# EAGLE design PoBoV1 (EAGLE 9.6.2)
ABTEILUNG: Technische Informatik; BEARBEITER: Stefan Sekulić; BENENNUNG: PowerHub; DATUM: 26.12.2024; DOKUMENTART: Schaltplan; GEZ: SekS; ID: 4BHEL; REV: 1.0; STATUS: Prototyp; VER: 1.0

## Sheet 1 of 5: THE INTELLIGENT PSU.
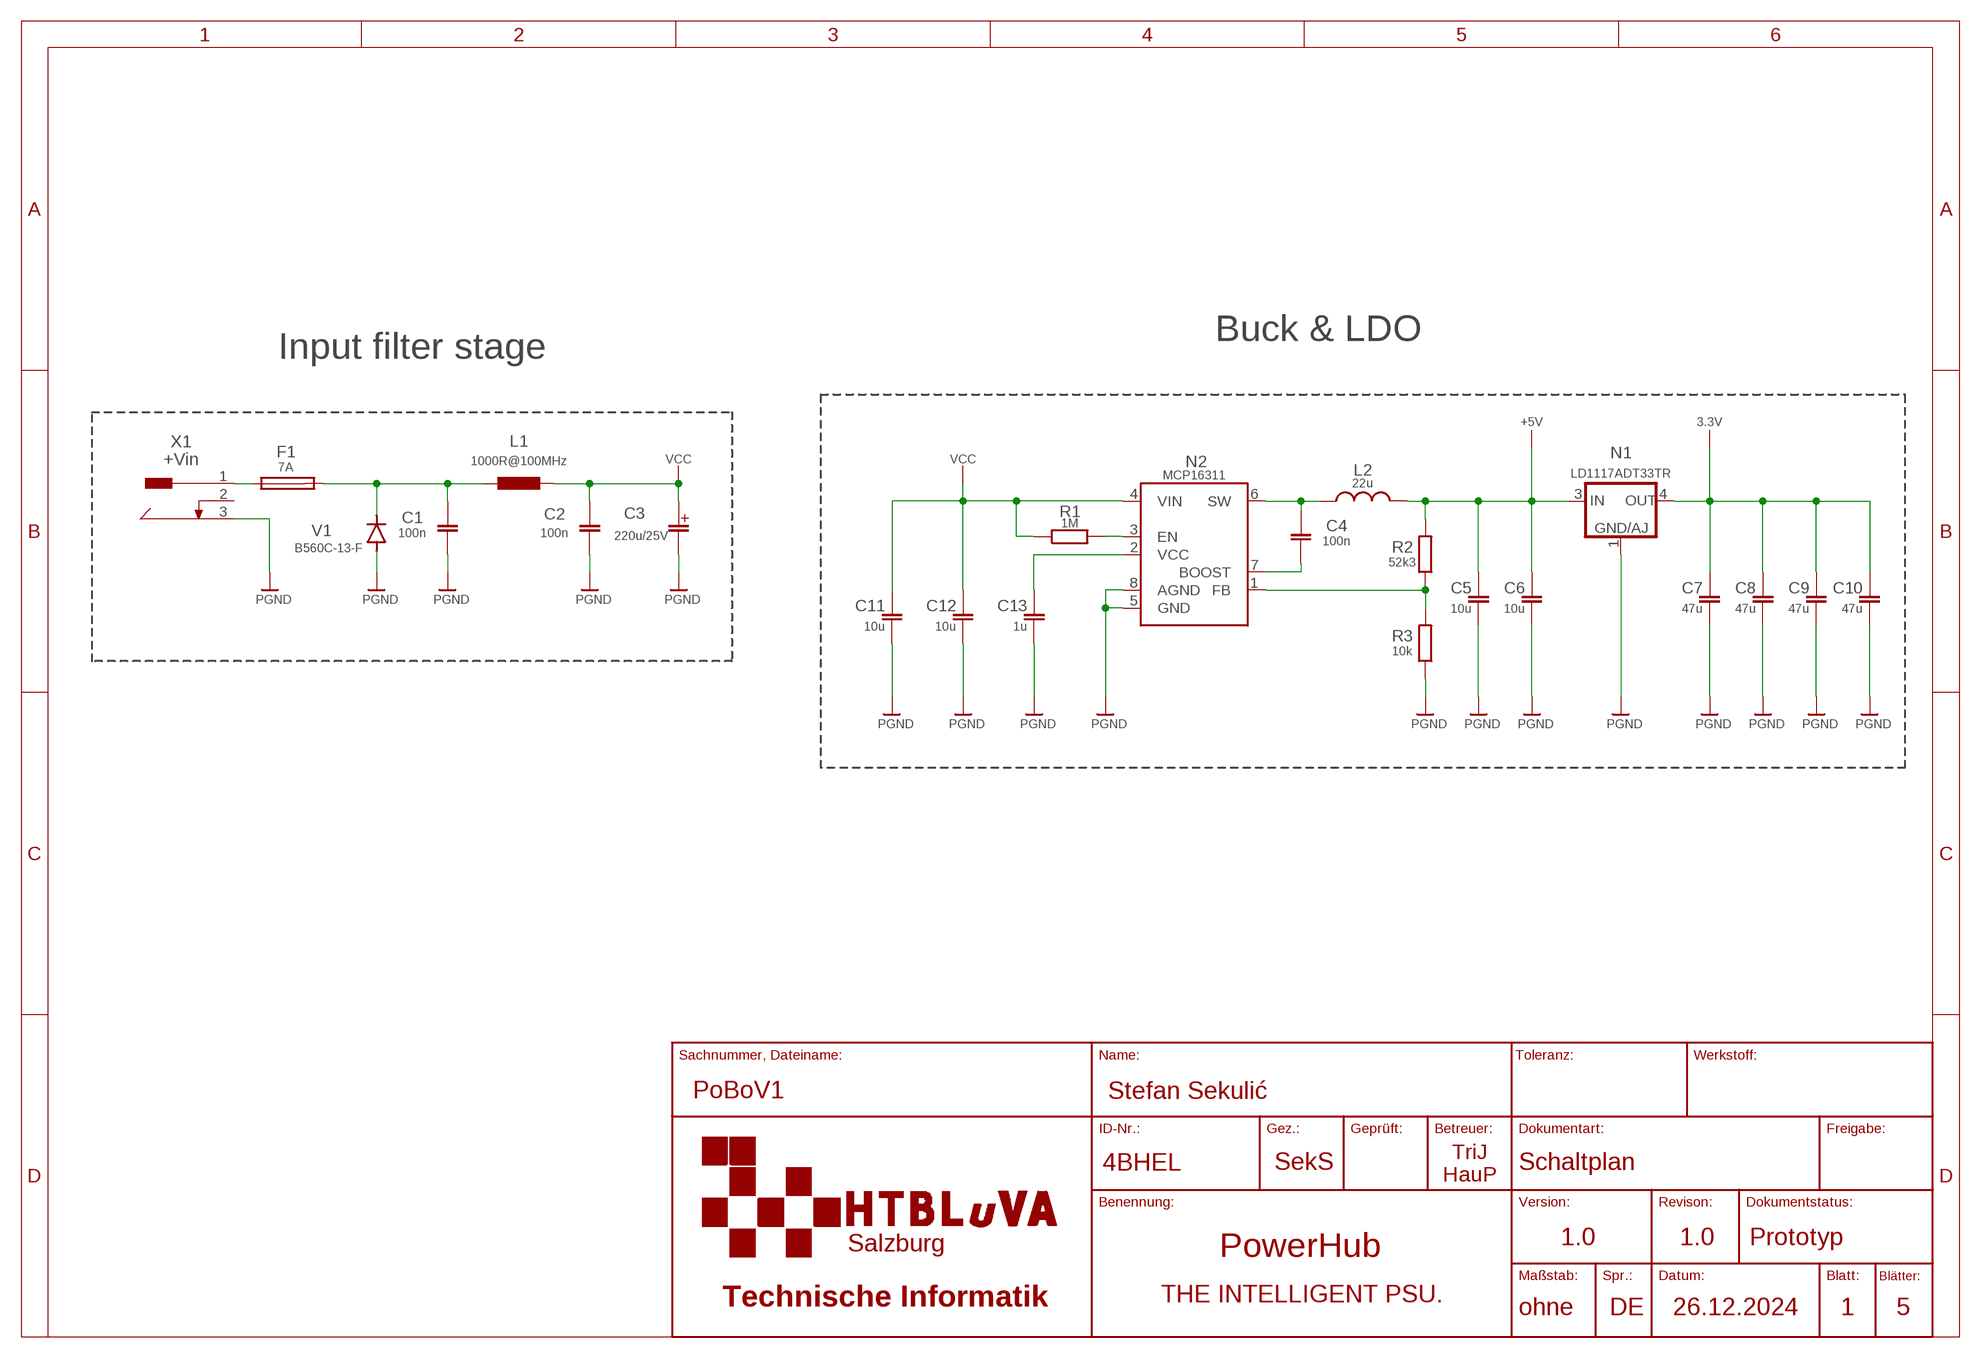
[diagram p0: schematic, sheet 1]

### Parts
C1  100n  C-EUC0805  [C0805]
C2  100n  C-EUC0805  [C0805]
C3  220u/25V  CPOL-EUE2,5-6L  [E2,5-6L]
C4  100n  C-EUC0805  [C0805]
C5  10u  C-EUC0805  [C0805]
C6  10u  C-EUC0805  [C0805]
C7  47u  C-EUC0805  [C0805]
C8  47u  C-EUC0805  [C0805]
C9  47u  C-EUC0805  [C0805]
C10  47u  C-EUC0805  [C0805]
C11  10u  C-EUC0805  [C0805]
C12  10u  C-EUC0805  [C0805]
C13  1u  C-EUC0805  [C0805]
F1  7A  TE5  [TE5]
L1  1000R@100MHz  L-EUL0204/7  [0204/7@1]
L2  22u  SPULETPC5818  [WE-TPC_5818/5828]
N1  LD1117ADT33TR  [DPACK]
N2  MCP16311  [MSOP8]
R1  1M  R-EU_R0805  [R0805]
R2  52k3  R-EU_R0805  [R0805]
R3  10k  R-EU_R0805  [R0805]
V1  B560C-13-F  [SMC]
X1  +Vin  DCJ0202  [DCJ0202]

### Nets
+3.3: C7.1 C8.1 C9.1 C10.1 N1.4(OUT) ; supply symbol labelled 3.3V ; also sheet 2,5
+5V: C5.1 C6.1 L2.2 N1.3(IN) R2.2 ; also sheet 2
N$1: F1.1 X1.1
N$2: C4.2 N2.7(BOOST)
N$19: N2.3(EN) R1.2
N$20: C1.1 F1.2 L1.1 V1.C
N$29: C4.1 L2.1 N2.6(SW)
N$31: N2.1(FB) R2.1 R3.2
N$34: C13.1 N2.2(VCC)
PGND: C1.2 C2.2 C3.- C5.2 C6.2 C7.2 C8.2 C9.2 C10.2 C11.2 C12.2 C13.2 N1.1(GND/ADJ) N2.5(GND) N2.8(AGND) R3.1 V1.A X1.3 ; also sheet 2,3,4,5
VCC: C2.1 C3.+ C11.1 C12.1 L1.2 N2.4(VIN) R1.1 ; also sheet 3,4
Unconnected: X1.2

### Notes on the sheet
- Buck & LDO
- Input filter stage
- TriJ
  HauP

## Sheet 2 of 5: THE INTELLIGENT PSU.
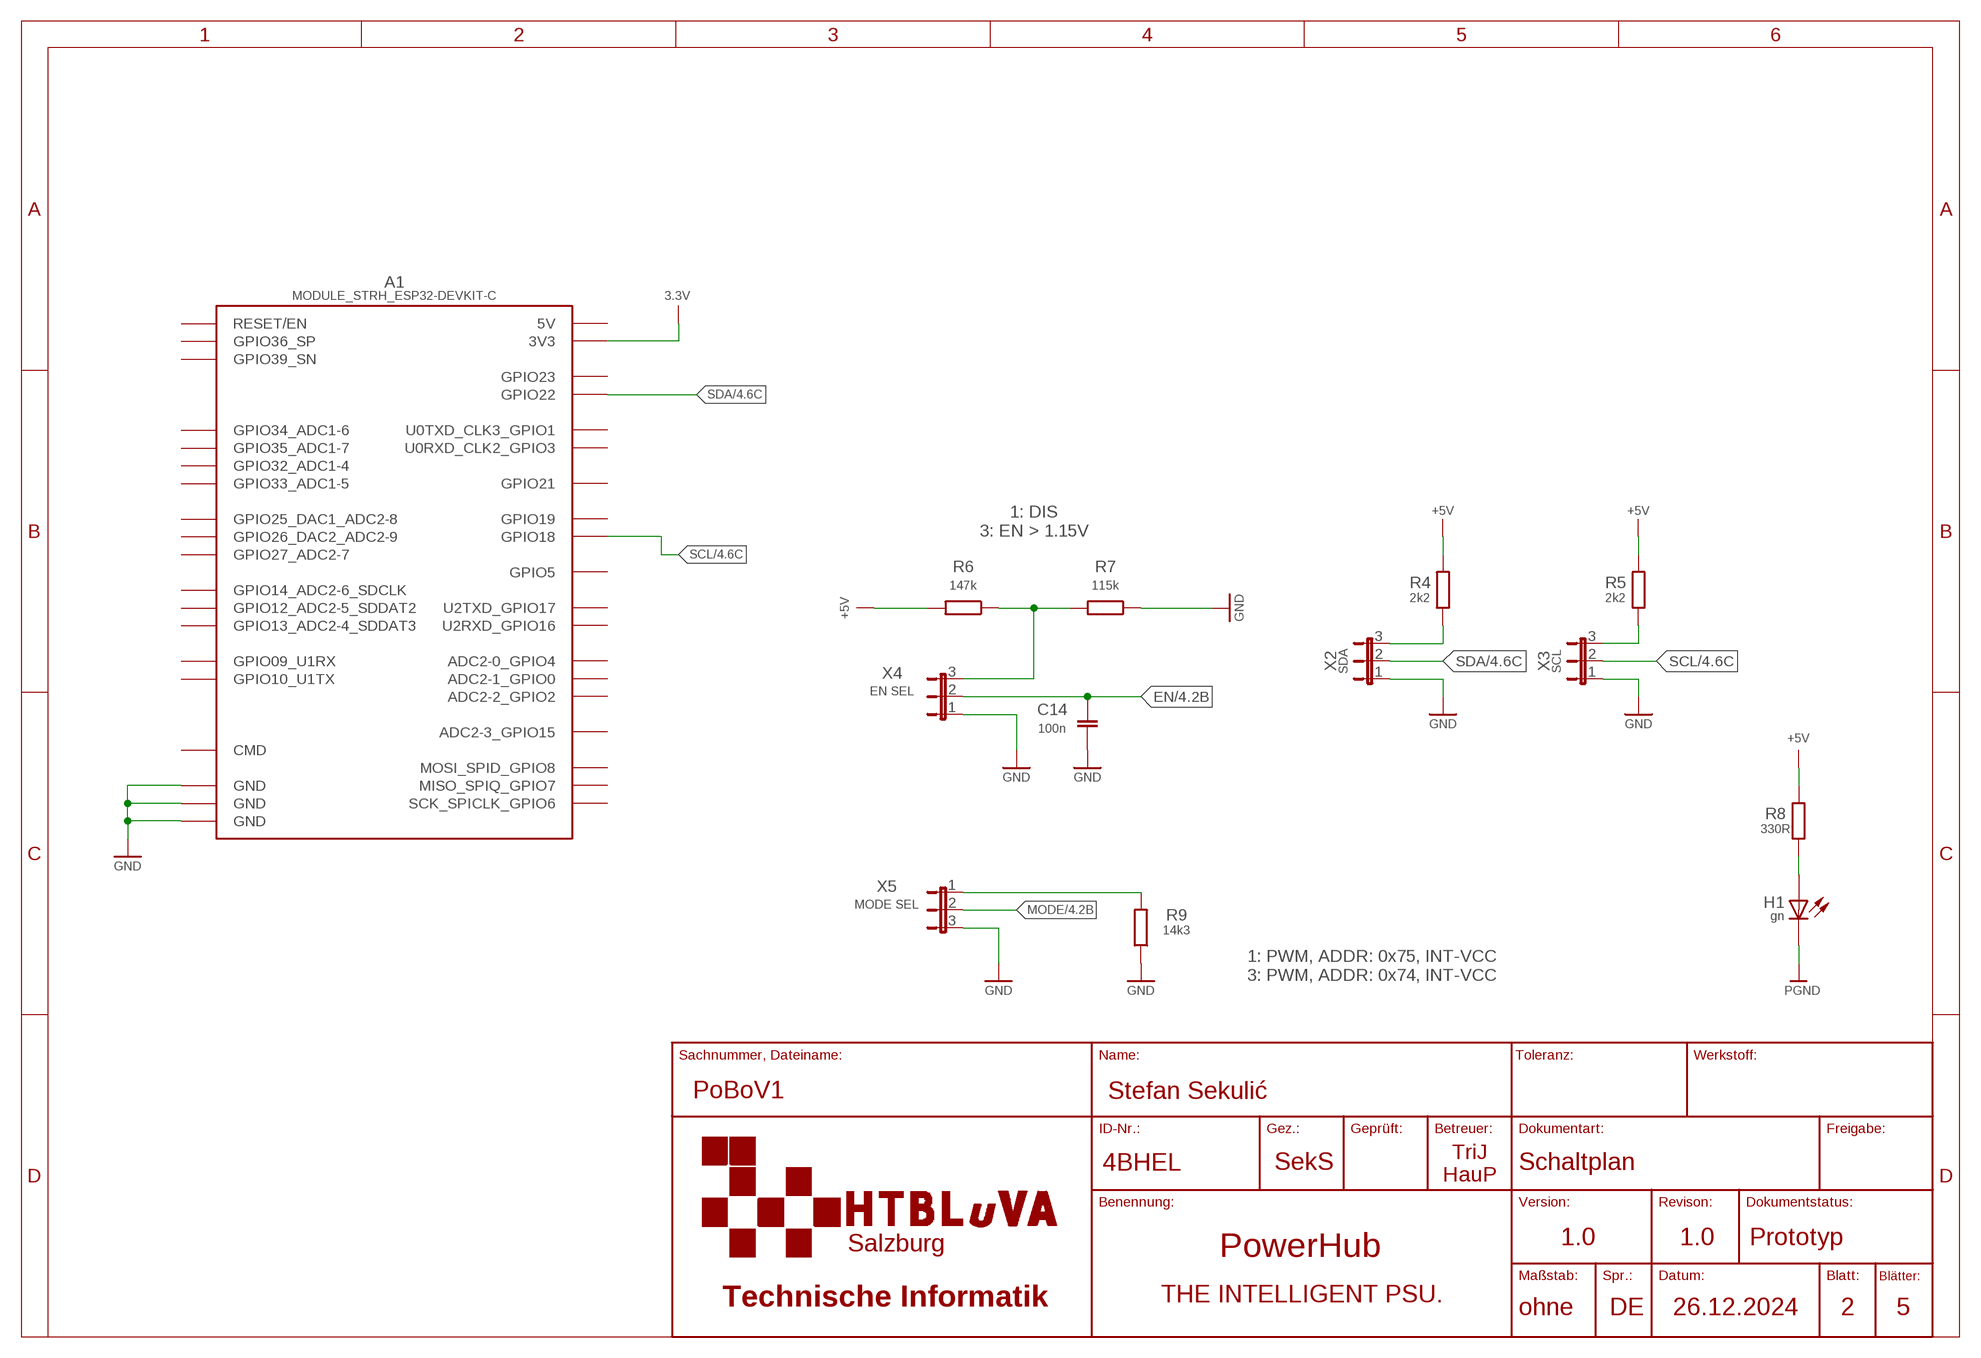
[diagram p1: schematic, sheet 2]

### Parts
A1  MODULE_STRH_ESP32-DEVKIT-C  [MODULE_STRH_DIL38-10_ESP]
C14  100n  C-EUC0805  [C0805]
H1  gn  LEDCHIPLED_0805  [CHIPLED_0805]
R4  2k2  R-EU_R0805  [R0805]
R5  2k2  R-EU_R0805  [R0805]
R6  147k  R-EU_R0805  [R0805]
R7  115k  R-EU_R0805  [R0805]
R8  330R  R-EU_R0805  [R0805]
R9  14k3  R-EU_R0805  [R0805]
X2  SDA  JUMPER_JP3EJP3E  [JUMPER_JP3]
X3  SCL  JUMPER_JP3EJP3E  [JUMPER_JP3]
X4  EN SEL  JUMPER_JP3EJP3E  [JUMPER_JP3]
X5  MODE SEL  JUMPER_JP3EJP3E  [JUMPER_JP3]

### Nets
+3.3: A1.3V3 ; supply symbol labelled 3.3V ; also sheet 1,5
+5V: R4.2 R5.2 R6.2 R8.2 ; also sheet 1
EN: C14.1 X4.2 ; also sheet 4
MODE: X5.2 ; also sheet 4
N$7: R6.1 R7.2 X4.3
N$9: R4.1 X2.3
N$10: R5.1 X3.3
N$17: H1.A R8.1
N$18: R9.2 X5.1
PGND: A1.GND A1.GND@1(GND) A1.GND@2(GND) C14.2 H1.C R7.1 R9.1 X2.1 X3.1 X4.1 X5.3 ; supply symbol labelled GND ; also sheet 1,3,4,5
SCL: A1.GPIO18 X3.2 ; also sheet 4,5
SDA: A1.GPIO22 X2.2 ; also sheet 4,5
Unconnected: A1.5V A1.CMD A1.EN(RESET/EN) A1.GPIO00(ADC2-1_GPIO0) A1.GPIO01(U0TXD_CLK3_GPIO1) A1.GPIO02(ADC2-2_GPIO2) A1.GPIO03(U0RXD_CLK2_GPIO3) A1.GPIO04(ADC2-0_GPIO4) A1.GPIO05(GPIO5) A1.GPIO06(SCK_SPICLK_GPIO6) A1.GPIO07(MISO_SPIQ_GPIO7) A1.GPIO08(MOSI_SPID_GPIO8) A1.GPIO09(GPIO09_U1RX) A1.GPIO10(GPIO10_U1TX) A1.GPIO12(GPIO12_ADC2-5_SDDAT2) A1.GPIO13(GPIO13_ADC2-4_SDDAT3) A1.GPIO14(GPIO14_ADC2-6_SDCLK) A1.GPIO15(ADC2-3_GPIO15) A1.GPIO16(U2RXD_GPIO16) A1.GPIO17(U2TXD_GPIO17) A1.GPIO19 A1.GPIO21 A1.GPIO23 A1.GPIO25(GPIO25_DAC1_ADC2-8) A1.GPIO26(GPIO26_DAC2_ADC2-9) A1.GPIO27(GPIO27_ADC2-7) A1.GPIO32(GPIO32_ADC1-4) A1.GPIO33(GPIO33_ADC1-5) A1.GPIO34(GPIO34_ADC1-6) A1.GPIO35(GPIO35_ADC1-7) A1.SN(GPIO39_SN) A1.SP(GPIO36_SP)

### Notes on the sheet
- 1: DIS
  3: EN > 1.15V
- 1: PWM, ADDR: 0x75, INT-VCC
  3: PWM, ADDR: 0x74, INT-VCC
- TriJ
  HauP

## Sheet 3 of 5: THE INTELLIGENT PSU.
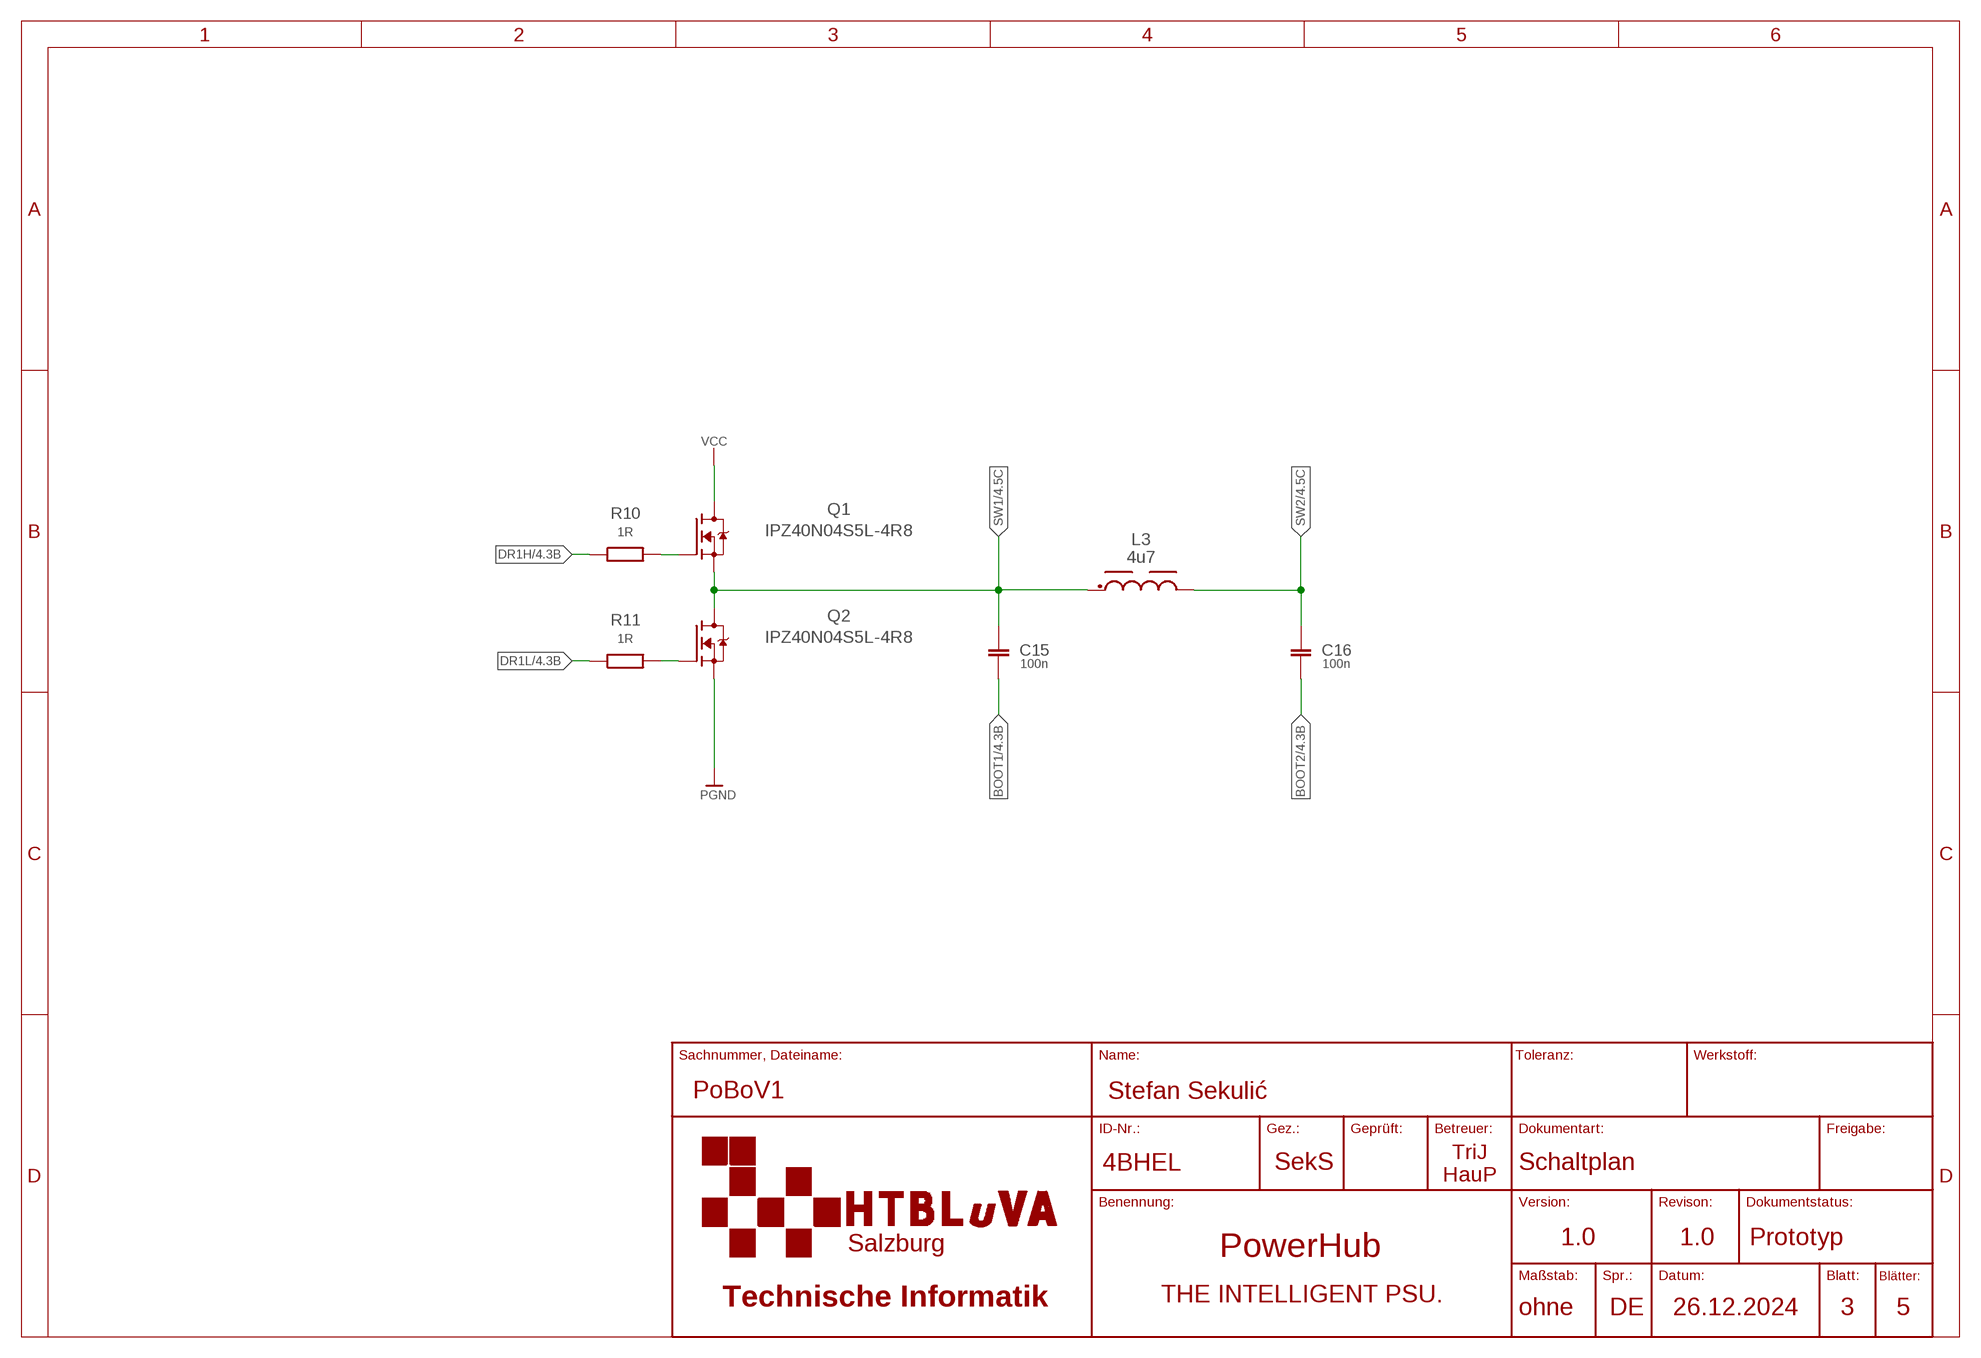
[diagram p2: schematic, sheet 3]

### Parts
C15  100n  C-EUC0805  [MYLIB_C0805]
C16  100n  C-EUC0805  [MYLIB_C0805]
L3  4u7  WE-PD_1280P  [WE-PD_1280P]
Q1  IPZ40N04S5L-4R8  BSZ100N06LS3_G  [TRANS_BSZ100N06LS3_G]
Q2  IPZ40N04S5L-4R8  BSZ100N06LS3_G  [TRANS_BSZ100N06LS3_G]
R10  1R  R-EU_R0805  [R0805]
R11  1R  R-EU_R0805  [R0805]

### Nets
BOOT1: C15.2 ; also sheet 4
BOOT2: C16.2 ; also sheet 4
DR1H: R10.1 ; also sheet 4
DR1L: R11.1 ; also sheet 4
N$3: Q1.4(G) R10.2
N$5: Q2.4(G) R11.2
PGND: Q2.1(S) Q2.2(S) Q2.3(S) ; also sheet 1,2,4,5
SW1: C15.1 L3.1 Q1.1(S) Q1.2(S) Q1.3(S) Q2.5_8(D) ; also sheet 4
SW2: C16.1 L3.2 ; also sheet 4
VCC: Q1.5_8(D) ; also sheet 1,4

### Notes on the sheet
- TriJ
  HauP

## Sheet 4 of 5: THE INTELLIGENT PSU.
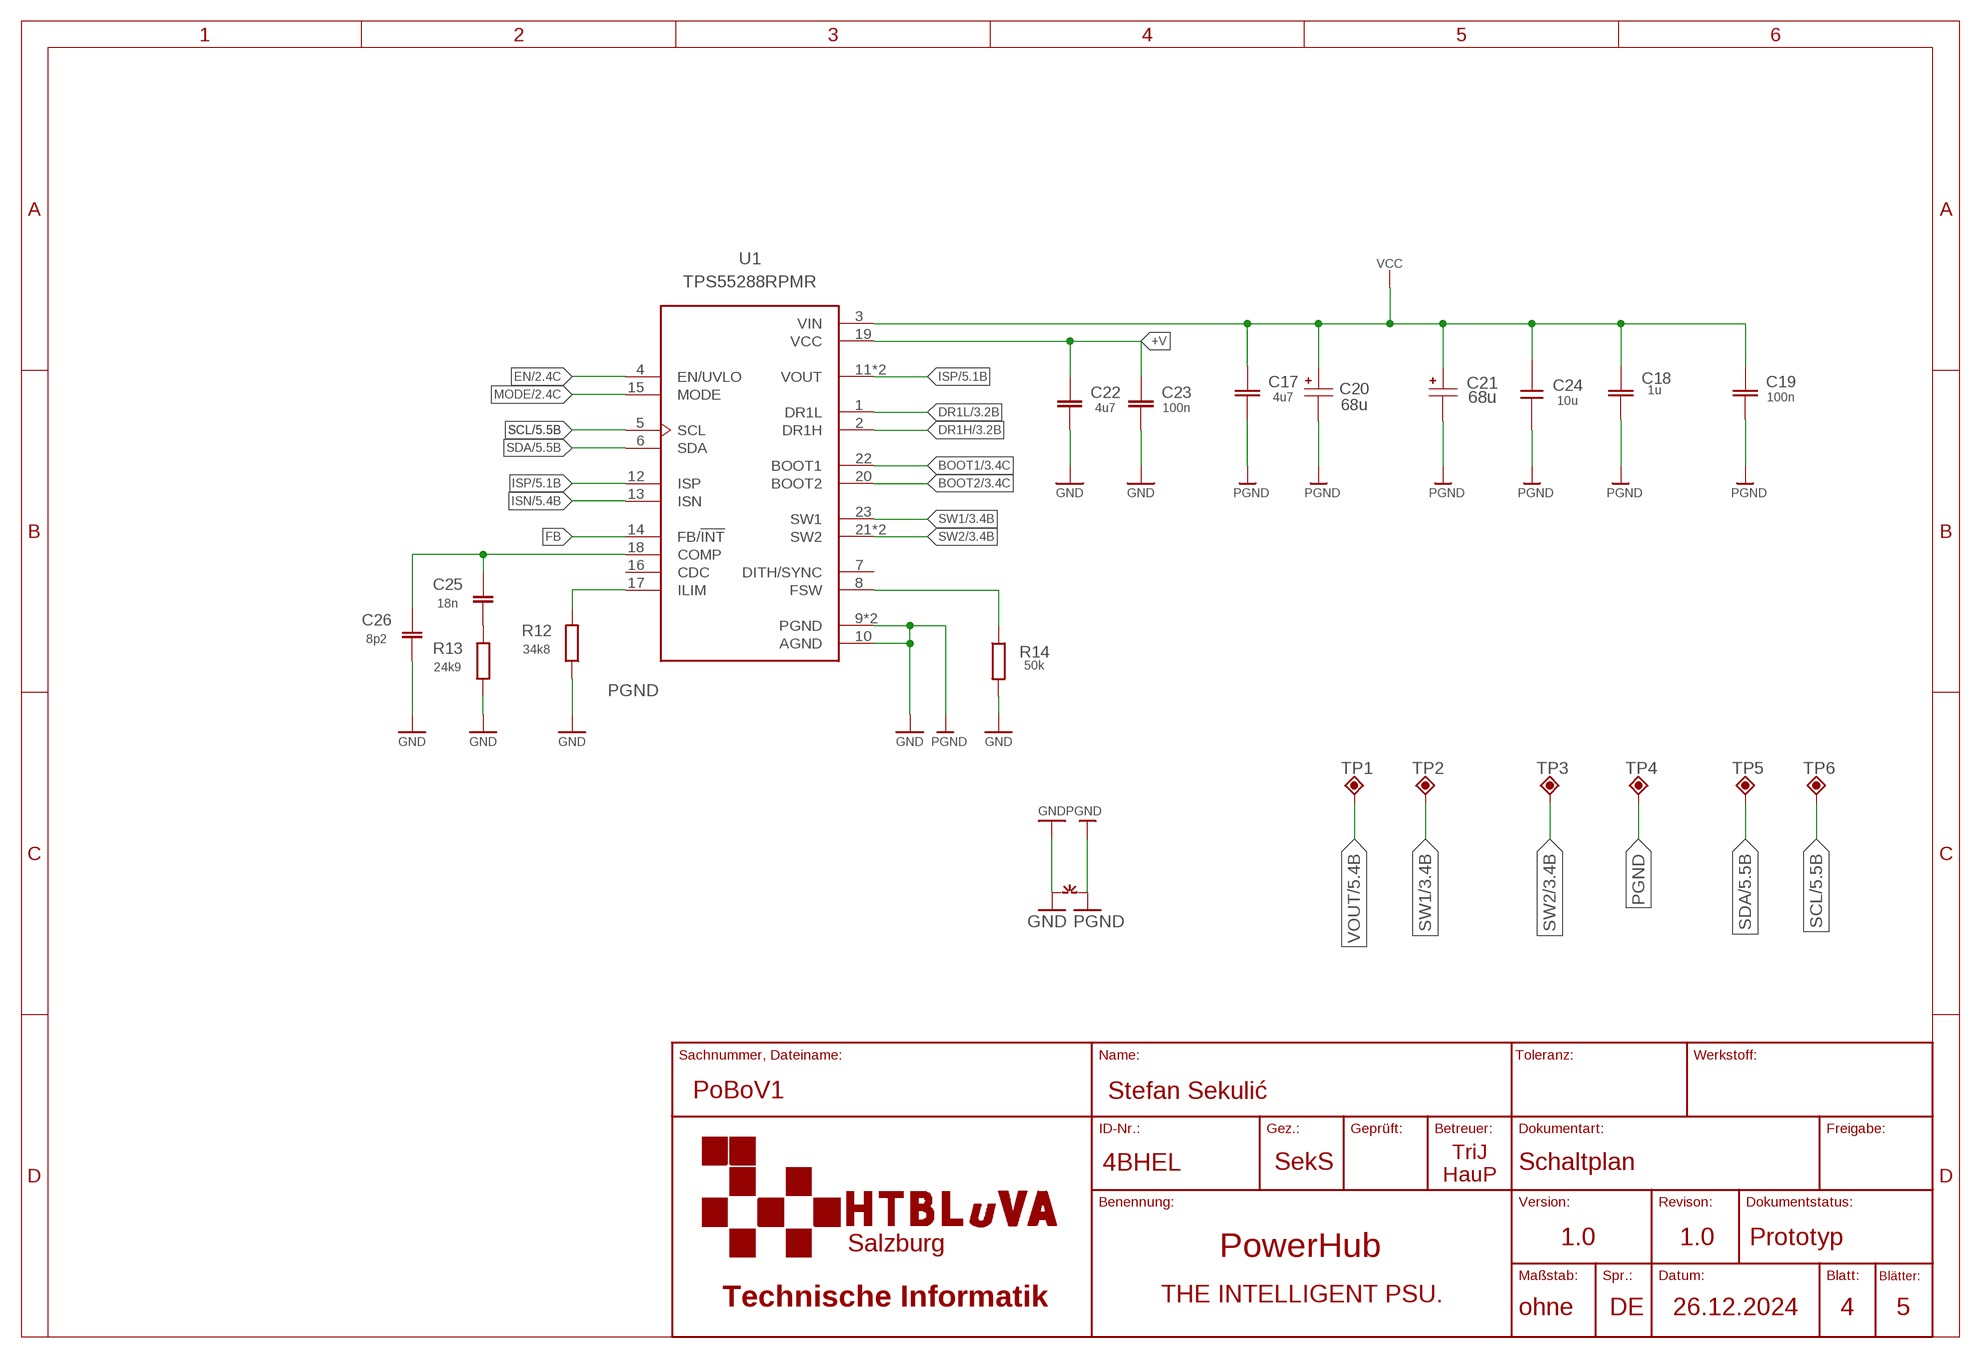
[diagram p3: schematic, sheet 4]

### Parts
C17  4u7  RCL_C-EUC0603  [MYRCL_C0603]
C18  1u  RCL_C-EUC0603K  [MYRCL_C0603K]
C19  100n  RCL_C-EUC0402  [MYRCL_C0402]
C20  68u  EEHZA1H680P  [CAP_EEHZA1H680P]
C21  68u  EEHZA1H680P  [CAP_EEHZA1H680P]
C22  4u7  RCL_C-EUC0603  [MYRCL_C0603]
C23  100n  RCL_C-EUC0603  [MYRCL_C0603]
C24  10u  C-EU_C1210  [C1210]
C25  18n  C-EUC0805  [MYLIB_C0805]
C26  8p2  C-EUC0805  [MYLIB_C0805]
R12  34k8  R-EU_R0805  [R0805]
R13  24k9  R-EU_R0805  [R0805]
R14  50k  R-EU_R0805  [R0805]
TP1  TPP-SMD-20SN  [SMD-20SN]
TP2  TPP-SMD-20SN  [SMD-20SN]
TP3  TPP-SMD-20SN  [SMD-20SN]
TP4  TPP-SMD-20SN  [SMD-20SN]
TP5  TPP-SMD-20SN  [SMD-20SN]
TP6  TPP-SMD-20SN  [SMD-20SN]
U1  TPS55288RPMR  [IC_TPS55288RPMR]
~NUDEV~1  GND-GNDA  [GND-GNDA]

### Nets
+V: C22.1 C23.1 U1.19(VCC)
BOOT1: U1.22(BOOT1) ; also sheet 3
BOOT2: U1.20(BOOT2) ; also sheet 3
DR1H: U1.2(DR1H) ; also sheet 3
DR1L: U1.1(DR1L) ; also sheet 3
EN: U1.4(EN/UVLO) ; also sheet 2
FB: U1.14(FB/!INT)
ISN: U1.13(ISN) ; also sheet 5
ISP: U1.11(VOUT) U1.12(ISP) U1.26(VOUT) ; also sheet 5
MODE: U1.15(MODE) ; also sheet 2
N$12: C25.2 R13.2
N$13: C25.1 C26.1 U1.18(COMP)
N$14: R14.1 U1.8(FSW)
N$15: R12.2 U1.17(ILIM)
PGND: C17.2 C18.2 C19.2 C20.2 C21.2 C22.2 C23.2 C24.2 C26.2 R12.1 R13.1 R14.2 TP4.TP(P) U1.9(PGND) U1.10(AGND) U1.24(PGND) ~NUDEV~1.GND ~NUDEV~1.PGND(GNDA) ; supply symbol labelled GND ; also sheet 1,2,3,5
SCL: TP6.TP(P) U1.5(SCL) ; also sheet 2,5
SDA: TP5.TP(P) U1.6(SDA) ; also sheet 2,5
SW1: TP2.TP(P) U1.23(SW1) ; also sheet 3
SW2: TP3.TP(P) U1.21(SW2) U1.25(SW2) ; also sheet 3
VCC: C17.1 C18.1 C19.1 C20.1 C21.1 C24.1 U1.3(VIN) ; also sheet 1,3
VOUT: TP1.TP(P) ; also sheet 5
Unconnected: U1.7(DITH/SYNC) U1.16(CDC)

### Notes on the sheet
- TriJ
  HauP

## Sheet 5 of 5: THE INTELLIGENT PSU.
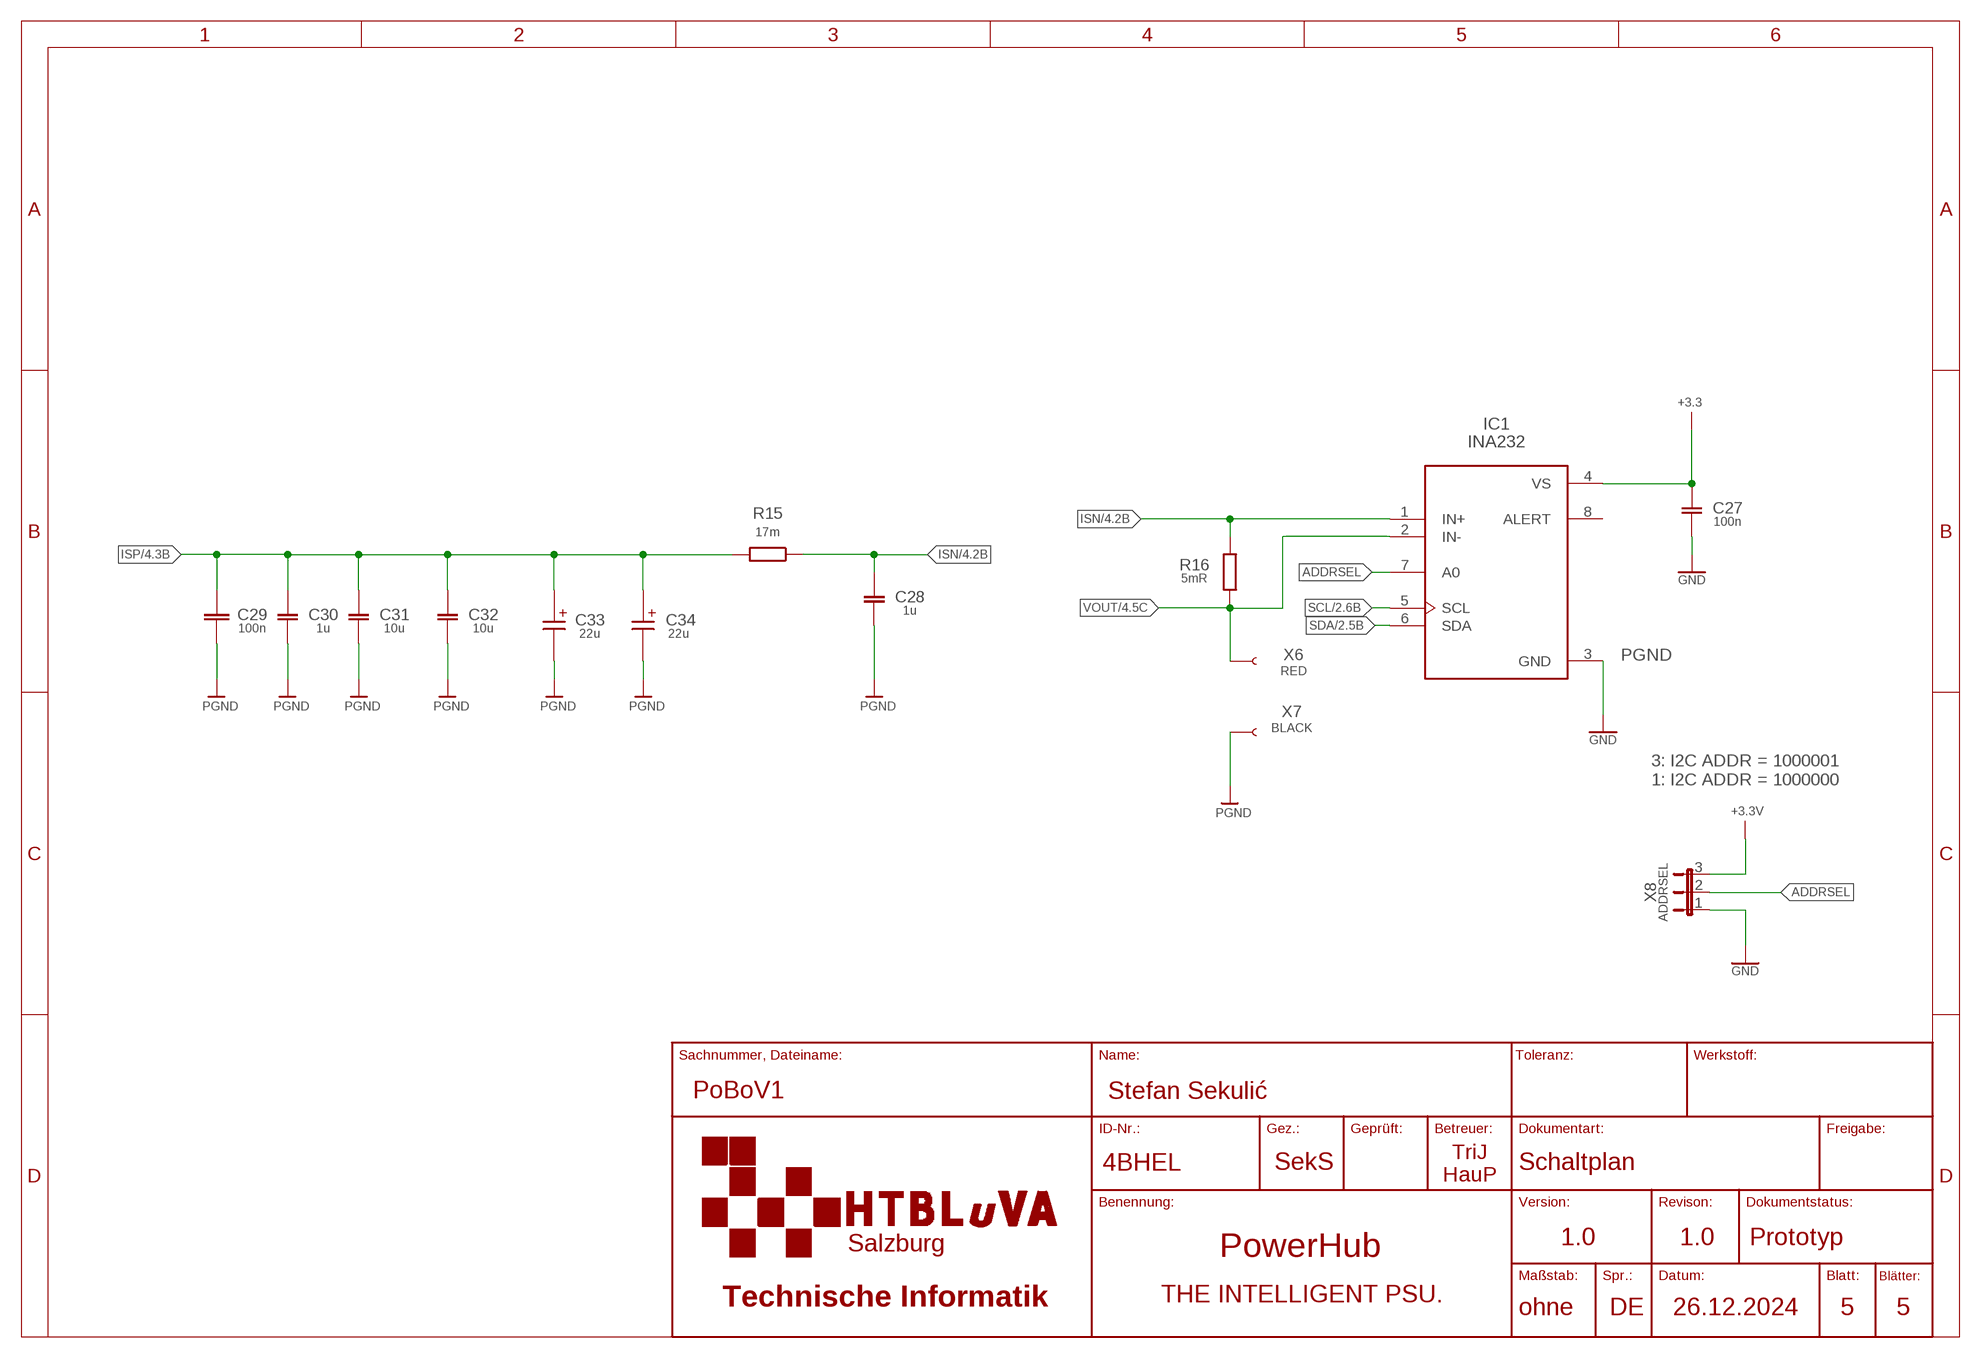
[diagram p4: schematic, sheet 5]

### Parts
C27  100n  C-EUC0805  [MYLIB_C0805]
C28  1u  C-EUC0805  [MYLIB_C0805]
C29  100n  RCL_C-EUC0402  [MYRCL_C0402]
C30  1u  C-EUC0805  [MYLIB_C0805]
C31  10u  C-EUC0805  [MYLIB_C0805]
C32  10u  C-EUC0805  [MYLIB_C0805]
C33  22u  C-POL_G  [PANASONIC_G]
C34  22u  C-POL_G  [PANASONIC_G]
IC1  INA232  INA232AIDDFR  [SOT65P280X110-8N]
R15  17m  R-EU_R0805  [R0805]
R16  5mR  RCL_STRH_R-EU_R0805  [RCL_STRH_R0805]
X6  RED  BANANAJACKBANANAJACK-RED  [BANANAJACK]
X7  BLACK  BANANAJACKBANANAJACK-BLACK  [BANANAJACK]
X8  ADDRSEL  JUMPER_JP3EJP3E  [JUMPER_JP3]

### Nets
+3.3: C27.1 IC1.4(VS) ; also sheet 1,2
+3.3V: X8.3
ADDRSEL: IC1.7(A0) X8.2
ISN: C28.1 IC1.1(IN+) R15.1 R16.2 ; also sheet 4
ISP: C29.1 C30.1 C31.1 C32.1 C33.+ C34.+ R15.2 ; also sheet 4
PGND: C27.2 C28.2 C29.2 C30.2 C31.2 C32.2 C33.- C34.- IC1.3(GND) X7.P$1 X8.1 ; supply symbol labelled GND ; also sheet 1,2,3,4
SCL: IC1.5(SCL) ; also sheet 2,4
SDA: IC1.6(SDA) ; also sheet 2,4
VOUT: IC1.2(IN-) R16.1 X6.P$1 ; also sheet 4
Unconnected: IC1.8(ALERT)

### Notes on the sheet
- 3: I2C ADDR = 1000001
  1: I2C ADDR = 1000000
- TriJ
  HauP

## Library data of the parts
A1 = Neo_V2.102R1 (1):MODULE_STRH_ESP32-DEVKIT-C
C1 C2 C4-C14 = rcl_STRH:C-EU: CAPACITOR, European symbol
C3 = rcl_STRH:CPOL-EU: POLARIZED CAPACITOR, European symbol
C15 C16 C25-C28 C30-C32 = RPoettinger:C-EU
C17-C19 C22 C23 C29 = RPoettinger:RCL_C-EU: CAPACITOR, European symbol
C20 C21 = EEHZA1H680P:EEHZA1H680P: Check availability <https://pricing.snapeda.com/parts/EEH-ZA1H680P/Panasonic%20Electronic/view-part?ref=eda>; AVAILABILITY: In Stock; CHECK_PRICES: https://www.snapeda.com/parts/EEH-ZA1H680P/Panasonic/view-part/?ref=eda; DESCRIPTION: Capacitor, Aluminum Electrolytic,Hybrid Al Lytic Cap, SMT ZA Series, 105C | Panasonic Electronic Components EEH-ZA1H680P; MF: Panasonic Electronic; MP: EEH-ZA1H680P; PACKAGE: RADIAL-2 Panasonic; PRICE: None; SNAPEDA_LINK: https://www.snapeda.com/parts/EEH-ZA1H680P/Panasonic/view-part/?ref=snap
C24 = rcl_SekS_V22:C-EU_: CAPACITOR, European symbol
C33 C34 = rcl_SekS_V22:C-POL_: POLARIZED CAPACITOR, European symbol
F1 = fuse_SekS:TE5: FUSE Wickmann; OC_FARNELL: unknown; OC_NEWARK: unknown
H1 = led_SekS_V21:LED: LED, EN-60617 OSRAM: - CHIPLED LG R971, LG N971, LY N971, LG Q971, LY Q971, LO R971, LY R971 LH N974, LH R974 LS Q976, LO Q976, LY Q976 LO Q996 - Hyper CHIPLED LW Q18S LB Q993, LB Q99A, LB R99A - SideLED LS A670, LO A670, LY A670, LG A670, LP A670 LB A673, LV A673, LT A673, LW A673 LH A674 LY A675 LS A676, LA A676, LO A676, LY A676, LW A676 LS A679, LY A679, LG A679 - Hyper Micro SIDELED® LS Y876, LA Y876, LO Y876, LY Y876 LT Y87S - SmartLED LW L88C, LW L88S LB L89C, LB L89S, LG L890 LS L89K, LO L89K, LY L89K LS L896, LA L896, LO L896, LY L896 - TOPLED LS T670, LO T670, LY T670, LG T670, LP T670 LSG T670, LSP T670, LSY T670, LOP T670, LYG T670 LG T671, LOG T671, LSG T671 LB T673, LV T673, LT T673, LW T673 LH T674 LS T676, LA T676, LO T676, LY T676, LB T676, LH T676, LSB T676, LW T676 LB T67C, LV T67C, LT T67C, LS T67K, LO T67K, LY T67K, LW E67C LS E67B, LA E67B, LO E67B, LY E67B, LB E67C, LV E67C, LT E67C LW T67C LS T679, LY T679, LG T679 LS T770, LO T770, LY T770, LG T770, LP T770 LB T773, LV T773, LT T773, LW T773 LH T774 LS E675, LA E675, LY E675, LS T675 LS T776, LA T776, LO T776, LY T776, LB T776 LHGB T686 LT T68C, LB T68C - Hyper Mini TOPLED® LB M676 - Mini TOPLED Santana® LG M470 LS M47K, LO M47K, LY M47K Source: http://www.osram.convergy.de LUXEON: - LUMILED® LXK2-PW12-R00, LXK2-PW12-S00, LXK2-PW14-U00, LXK2-PW14-V00 LXK2-PM12-R00, LXK2-PM12-S00, LXK2-PM14-U00 LXK2-PE12-Q00, LXK2-PE12-R00, LXK2-PE12-S00, LXK2-PE14-T00, LXK2-PE14-U00 LXK2-PB12-K00, LXK2-PB12-L00, LXK2-PB12-M00, LXK2-PB14-N00, LXK2-PB14-P00, LXK2-PB14-Q00 LXK2-PR12-L00, LXK2-PR12-M00, LXK2-PR14-Q00, LXK2-PR14-R00 LXK2-PD12-Q00, LXK2-PD12-R00, LXK2-PD12-S00 LXK2-PH12-R00, LXK2-PH12-S00 LXK2-PL12-P00, LXK2-PL12-Q00, LXK2-PL12-R00 Source: www.luxeon.com KINGBRIGHT: KA-3528ASYC Source: www.kingbright.com
IC1 = INA232AIDDFR:INA232AIDDFR: Check availability <https://pricing.snapeda.com/parts/INA232AIDDFR/Texas%20Instruments/view-part?ref=eda>; AVAILABILITY: In Stock; CHECK_PRICES: https://www.snapeda.com/parts/INA232AIDDFR/Texas+Instruments/view-part/?ref=eda; DESCRIPTION: 48-V, 16-bit high-precision I²C output digital power monitor with alert; MF: Texas Instruments; MP: INA232AIDDFR; PACKAGE: SOT-23-THN-8 Texas Instruments; PRICE: None; SNAPEDA_LINK: https://www.snapeda.com/parts/INA232AIDDFR/Texas+Instruments/view-part/?ref=snap
L1 = rcl_STRH:L-EUL: INDUCTOR, European symbol; SPICEPREFIX: L
L2 = inductor_STRH:SPULE
L3 = WE-PD_1280P:WE-PD_1280P: WE-PD SMT Power Inductor Characteristics AECQ 200 Qualified Ultra low RDC and RAC Highest possible saturation current based on Ferrite Suitable for switching frequency up to 10MHz Temperature dependent parameter available on Redexpert Operating Temperature from -40°C to +125°C / +150°C Types WE-PD: Since always with low loss material, tight tolerances and high saturation behavior compared to other manufacturers in the market WE-PD Robust: Plastic base improves the mechanical stability and efficiency WE-PD Performance: MnZn core improves Saturation and RDC for highest efficiency Applications Switch Mode Power supplies from 0,1W up to 300W Integrated DC DC Converter Ideal for Switch Mode Power supplies with extreme high efficiency (>95%) <https://www.we-online.com/components/media/o194227v209%20Family_WE-PD.jpg> Details see: www.we-online.com/en/components/products/WE-PD Updated by Ella Wu 2023-02-17 2023 (C) Wurth Elektronik Check availability <https://pricing.snapeda.com/parts/7447707047/Wurth%20Elektronik/view-part?ref=eda>; AVAILABILITY: In Stock; CHECK_PRICES: https://www.snapeda.com/parts/7447707047/Wurth+Electronics/view-part/?ref=eda; DESCRIPTION: Size 1280; L = 4,7 µH ±30%; IR = 8,5 A; Isat = 15,5 A; RDC = 10 mΩ; MF: Wurth Elektronik; MP: 7447707047; PACKAGE: None; PRICE: None; SNAPEDA_LINK: https://www.snapeda.com/parts/7447707047/Wurth+Electronics/view-part/?ref=snap
N1 = v-reg_STRH:LD1117A?*: Low drop fixed and adjustable positive voltage regulators 1 A Source: http://www.st.com/stonline/products/literature/ds/7194/ld1117axx.pdf
N2 = v-reg_STRH:MCP16311
Q1 Q2 = BSZ100N06LS3_G:BSZ100N06LS3_G: Check availability <https://pricing.snapeda.com/parts/BSZ100N06LS3%20G/Infineon/view-part?ref=eda>; AVAILABILITY: In Stock; CHECK_PRICES: https://www.snapeda.com/parts/BSZ100N06LS3%20G/Infineon/view-part/?ref=eda; DESCRIPTION: MOSFET N-Ch 60V 20A TSDSON-8 OptiMOS 3; MF: Infineon; MP: BSZ100N06LS3 G; PACKAGE: PowerVDFN-8 Infineon Technologies; PRICE: None; SNAPEDA_LINK: https://www.snapeda.com/parts/BSZ100N06LS3%20G/Infineon/view-part/?ref=snap
R1-R9 = rcl_STRH:R-EU_: RESISTOR, European symbol
R10-R15 = RPoettinger:R-EU_: RESISTOR, European symbol
R16 = Neo_V2.102R1:RCL_STRH_R-EU_: RESISTOR, European symbol
TP1-TP6 = testpoint:TPP: TEST POINT PAD; BOM: EXCLUDE
U1 = TPS55288RPMR:TPS55288RPMR: Check availability <https://pricing.snapeda.com/parts/TPS55288RPMR/Texas%20Instruments/view-part?ref=eda>; AVAILABILITY: In Stock; CHECK_PRICES: https://www.snapeda.com/parts/TPS55288RPMR/Texas+Instruments/view-part/?ref=eda; DESCRIPTION: 36V, 16A buck-boost converter with PPS control; MF: Texas Instruments; MP: TPS55288RPMR; PACKAGE: VQFN-HR-26 Texas Instruments; PRICE: None; PURCHASE-URL: https://www.snapeda.com/api/url_track_click_mouser/?unipart_id=4817645&manufacturer=Texas Instruments&part_name=TPS55288RPMR&search_term=None; SNAPEDA_LINK: https://www.snapeda.com/parts/TPS55288RPMR/Texas+Instruments/view-part/?ref=snap
V1 = B560C-13-F:B560C-13-F: Diode Schottky 700mA 5A inverse 60V Check availability <https://pricing.snapeda.com/parts/B560C-13-F/Diodes%20Inc./view-part?ref=eda>; AVAILABILITY: In Stock; CHECK_PRICES: https://www.snapeda.com/parts/B560C-13-F/Diodes+Inc./view-part/?ref=eda; DESCRIPTION: Diode Schottky 60 V 5A Surface Mount SMC; MF: Diodes Inc.; MP: B560C-13-F; PACKAGE: SMC-2 Diodes; PRICE: None; SNAPEDA_LINK: https://www.snapeda.com/parts/B560C-13-F/Diodes+Inc./view-part/?ref=snap
X1 = StefkeJack:DCJ0202: DC POWER JACK Source: DCJ0202.pdf; OC_FARNELL: unknown; OC_NEWARK: unknown
X2-X5 = RPoettinger:JUMPER_JP3E: JUMPER
X6 X7 = con_PoeD:BANANAJACK
X8 = StefNe555:JUMPER_JP3E: JUMPER
~NUDEV~1 = supply-dummy:GND-GNDA: Example of GND--GNDA NET-Connetor for more info read description in package

## Net classes
1 GND: width 0.508 mm
2 SUP: width 0.508 mm

## Board
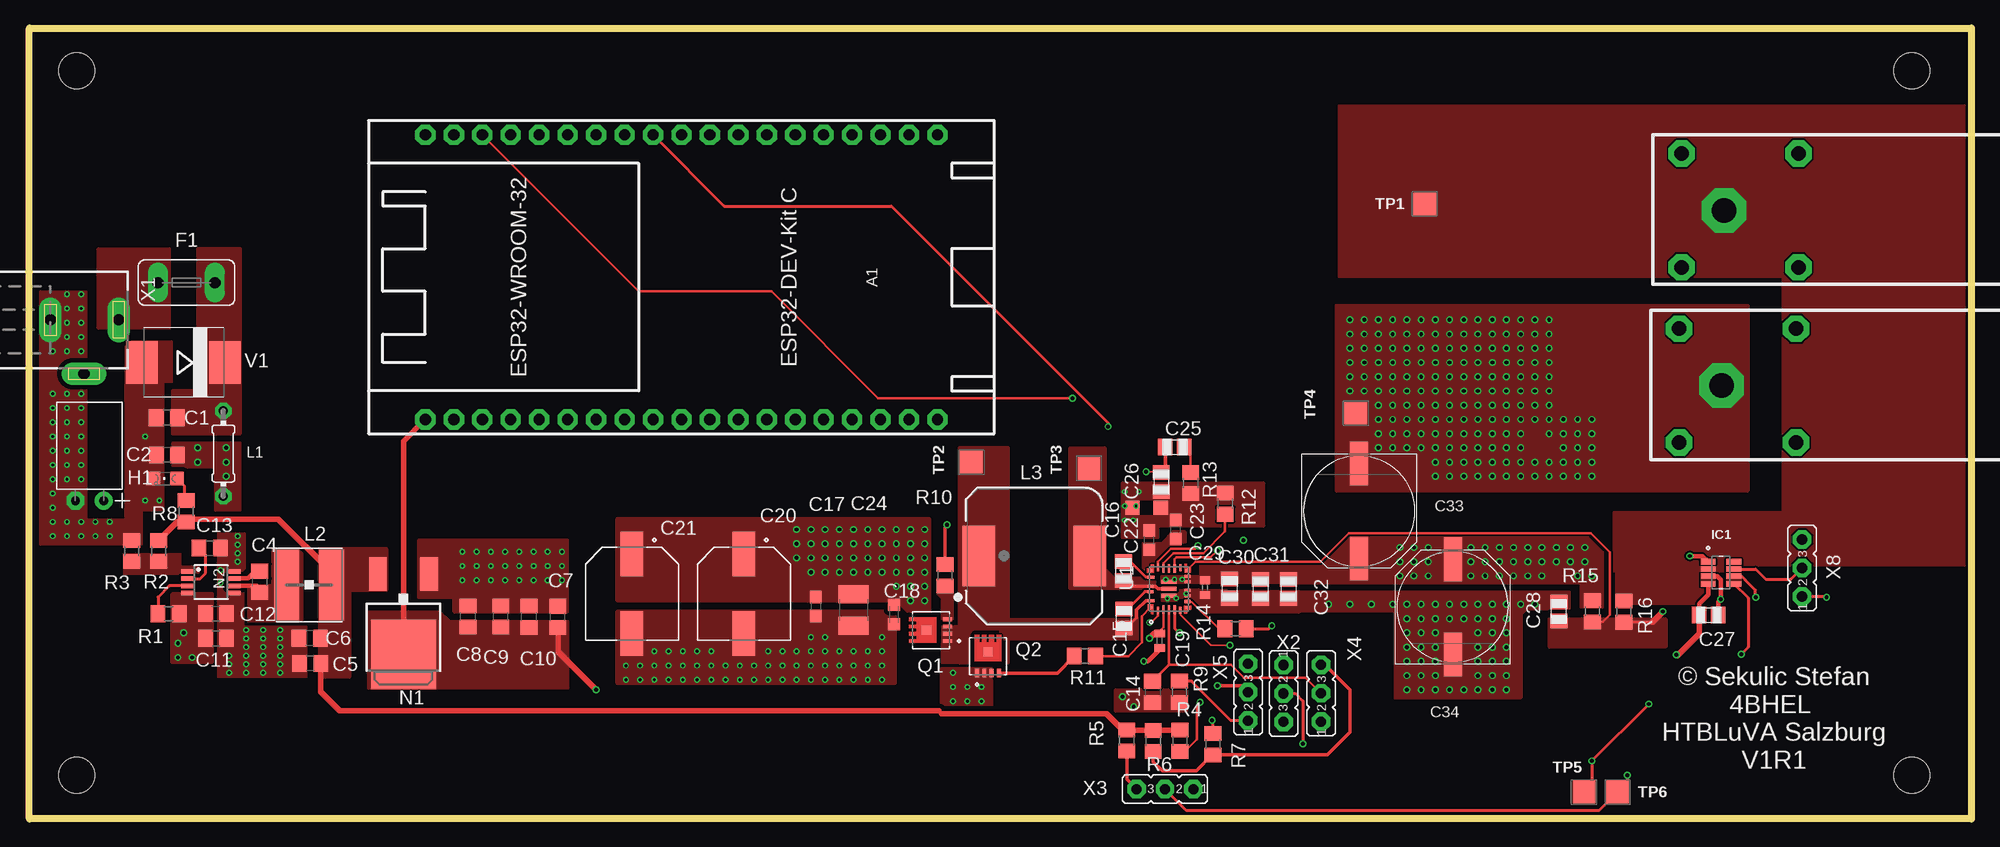
[diagram p5: board, top side]
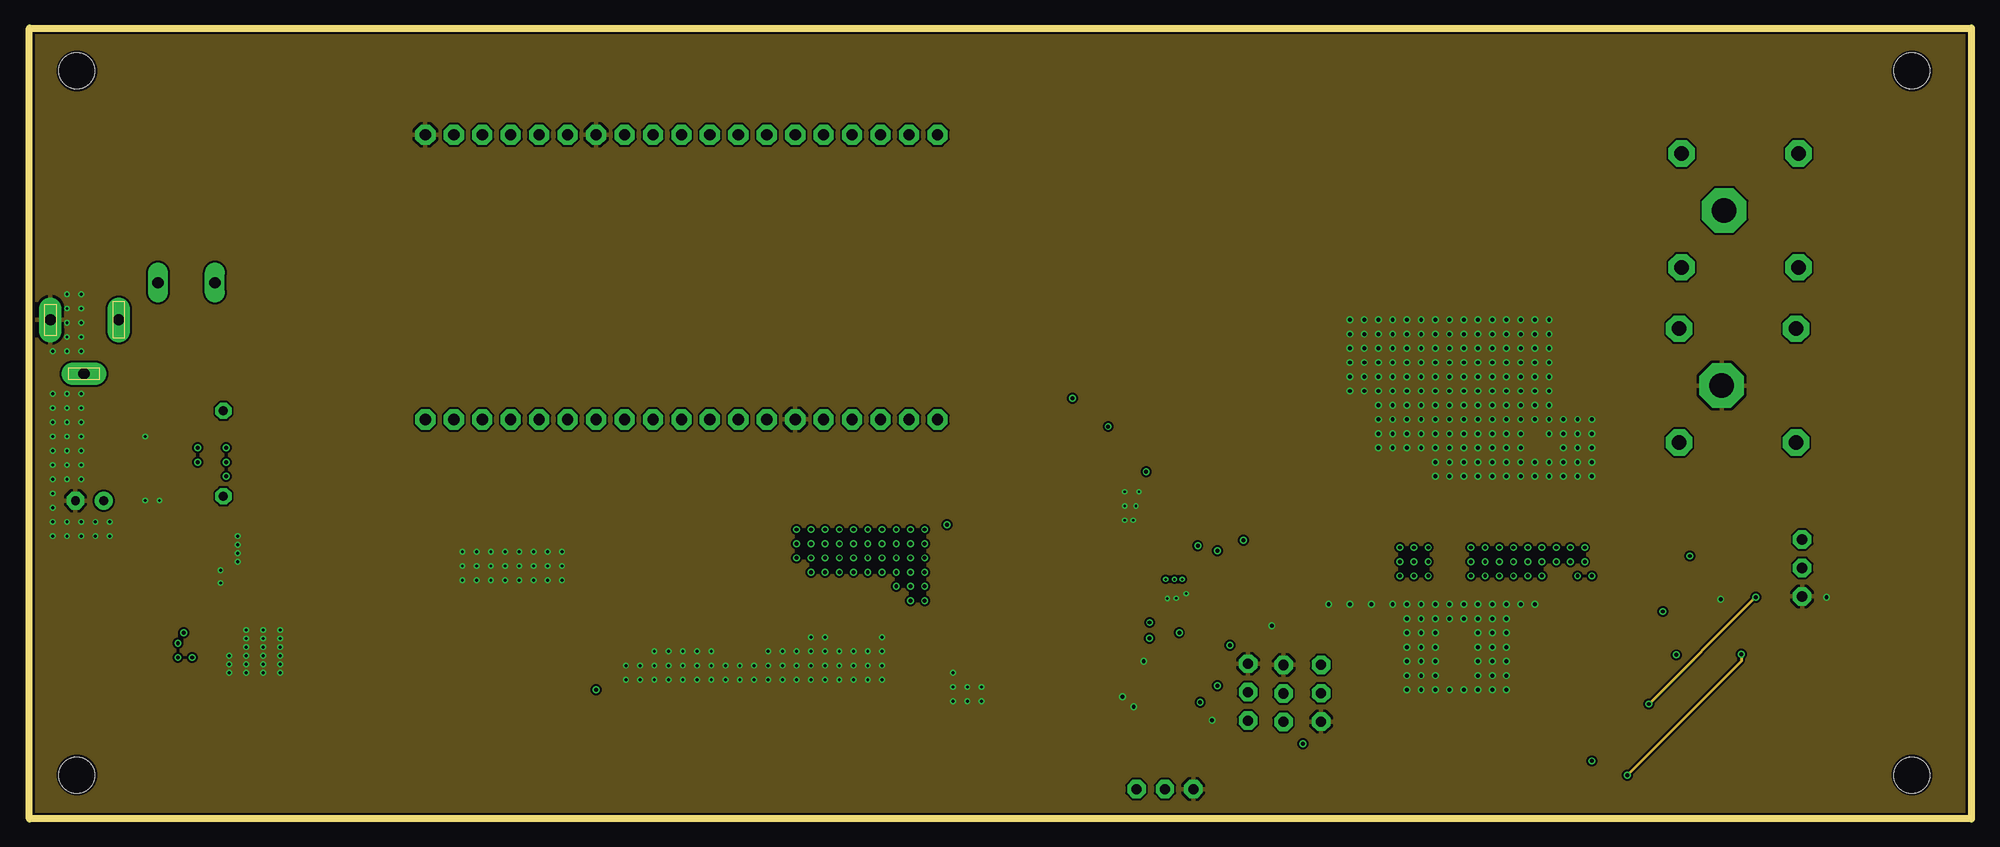
[diagram p6: board, inner layer Route2]
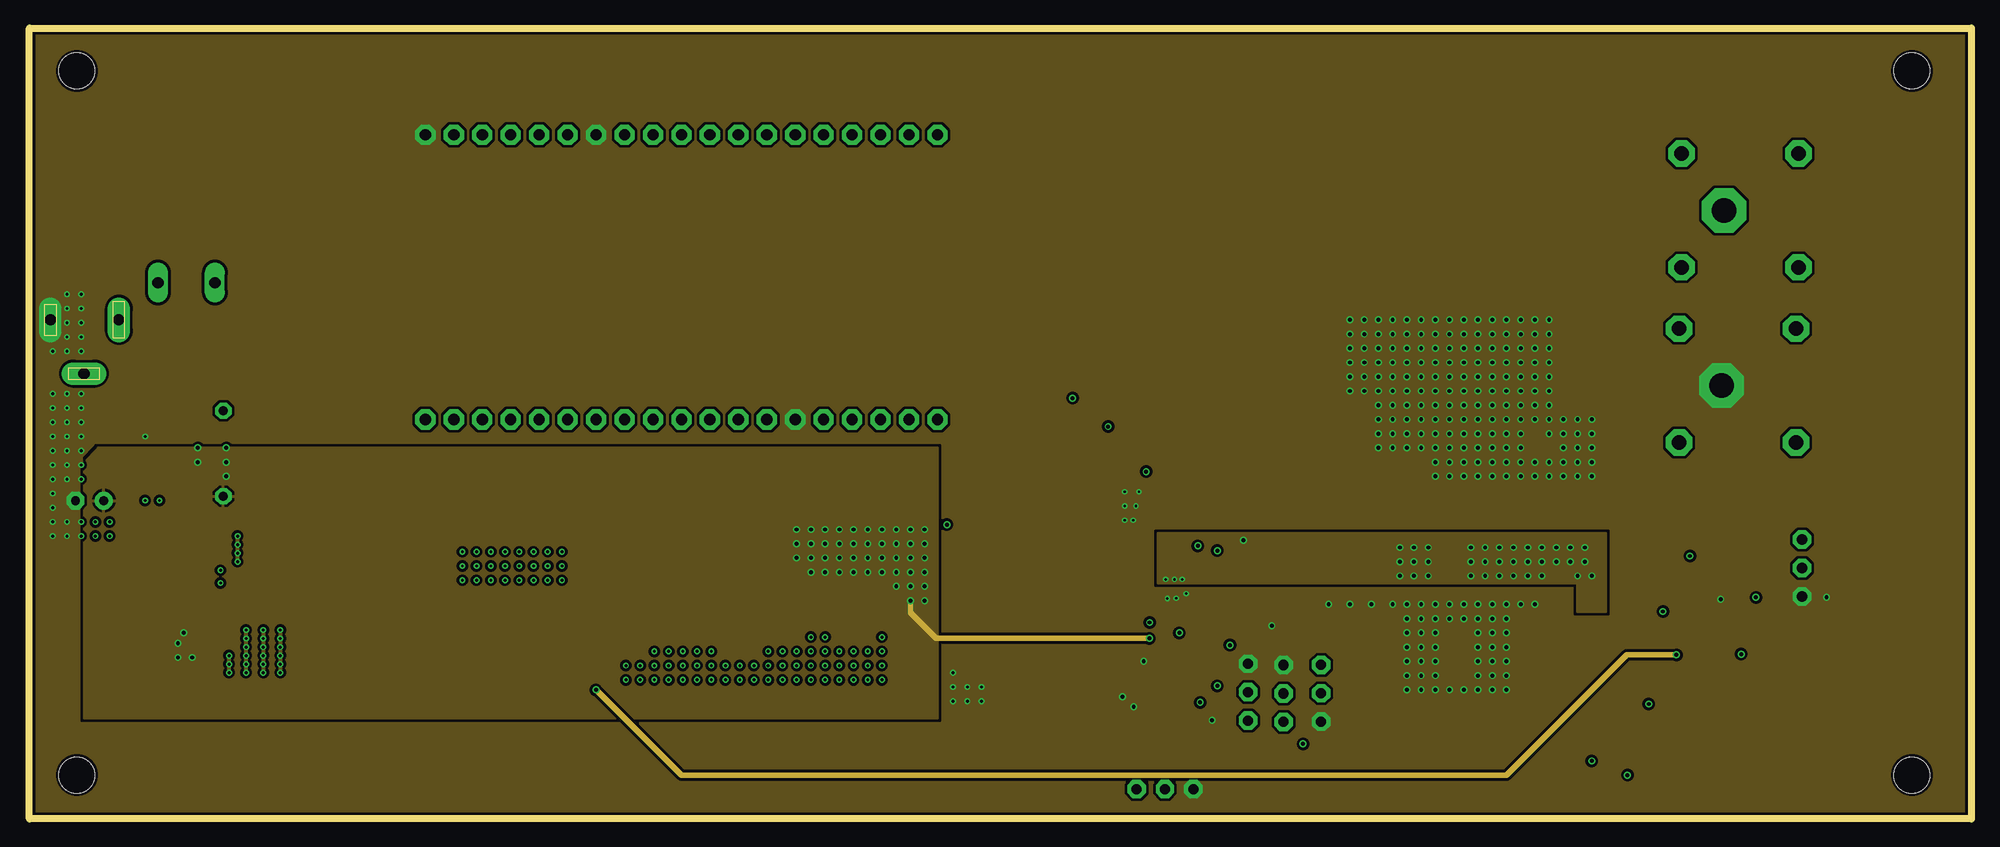
[diagram p7: board, inner layer Route15]
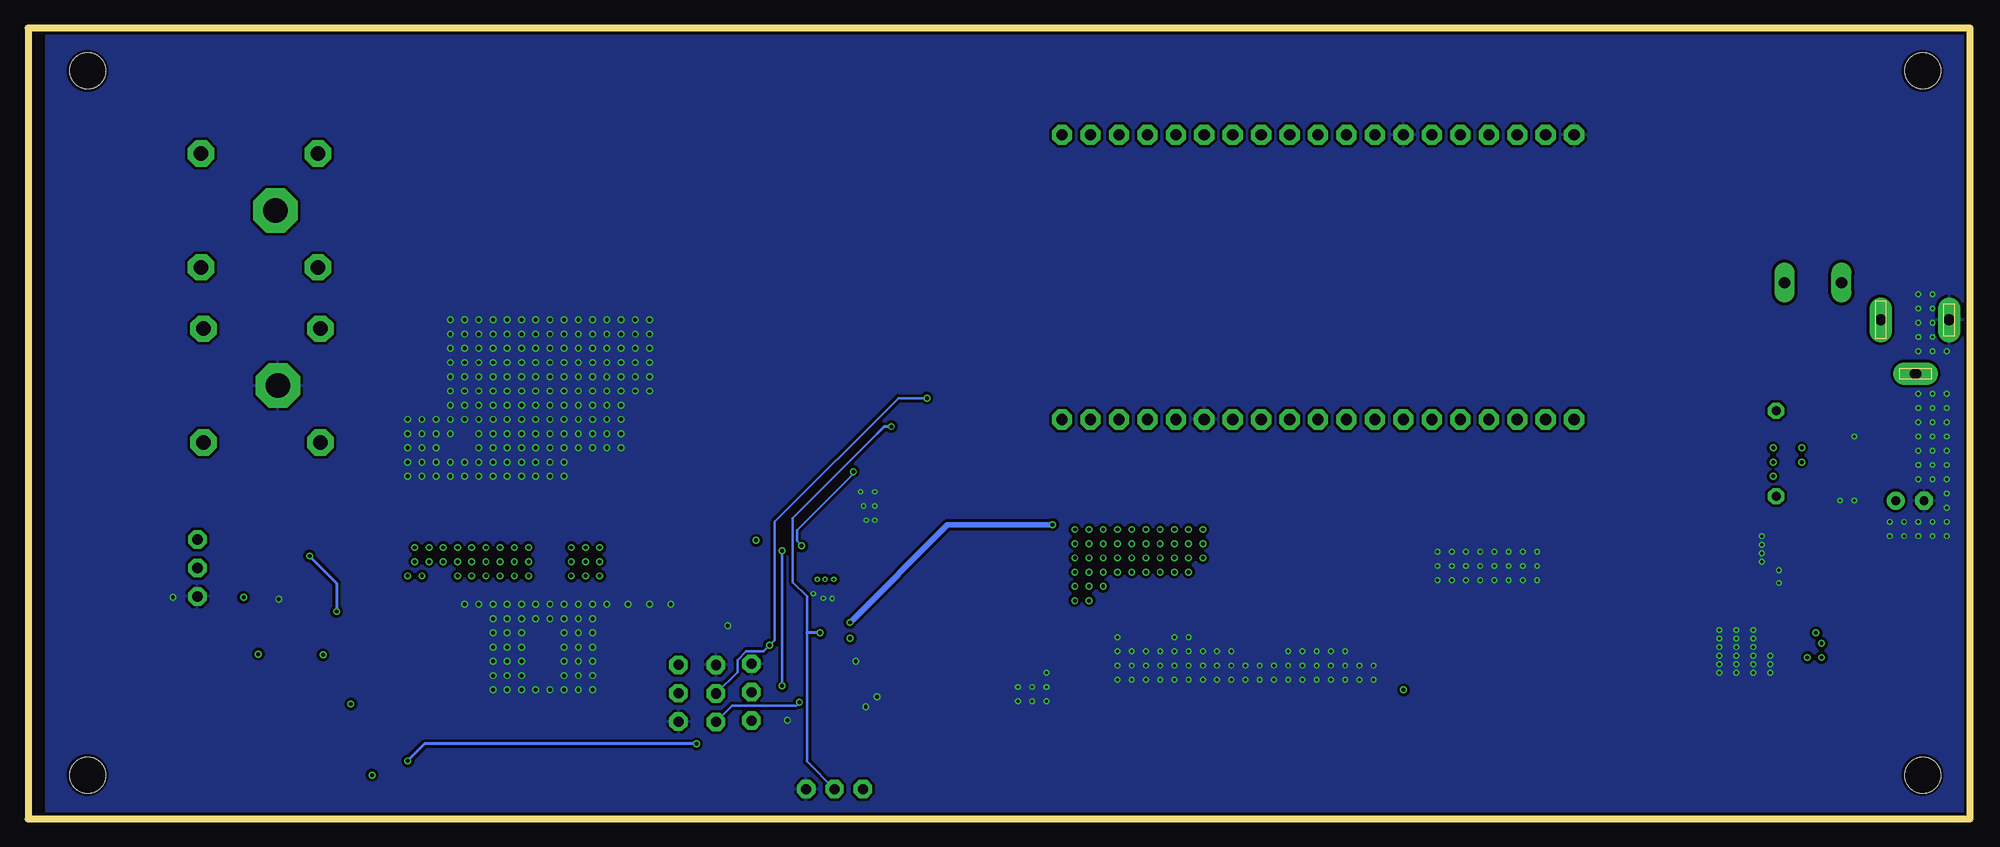
[diagram p8: board, bottom side, seen from below]

Size 173.4 x 70.6 mm. Coordinates in mm from the lower left corner, seen from the top.
Outline: 173.4,0 0,0 0,70.6 173.4,70.6 173.4,0
Copper layers (1+2*15+16): Top 0.035mm / dielectric 0.2mm / Route2 0.0175mm / dielectric 1.065mm / Route15 0.0175mm / dielectric 0.2mm / Bottom 0.035mm
Design rules "jlcpcb-4layers *": minimum track width 3.5mil, minimum drill 0.2mm, track to track 7mil, track to pad 0.2mm, pad to pad 5mil, via to via 0.5mm, smd to smd 5mil, copper to edge 0.2mm, drill to drill 6mil, minimum pad ring 10mil, minimum via ring 0.13mm, stop-mask expansion 0.05mm, vias tented up to drill 16mil, thermal gap 10mil
Holes 3.2 mm at 168.07,3.91 168.07,66.77 4.25,3.91 4.25,66.77

### Footprints (pad centres in the part's own frame; a part is rotated, then mirrored left to right if it is on the bottom)
MODULE_STRH_DIL38-10_ESP = drill 1 octagon: 3V3 -12.7,22.86; 5V -12.7,-22.86; CMD -12.7,-20.32; EN -12.7,20.32; GND -12.7,-10.16; GND@1 12.7,7.62; GND@2 12.7,22.86; GPIO00 12.7,-10.16; GPIO01 12.7,15.24; GPIO02 12.7,-12.7; GPIO03 12.7,12.7; GPIO04 12.7,-7.62; GPIO05 12.7,0; GPIO06 12.7,-22.86; GPIO07 12.7,-20.32; GPIO08 12.7,-17.78; GPIO09 -12.7,-15.24; GPIO10 -12.7,-17.78; GPIO12 -12.7,-7.62; GPIO13 -12.7,-12.7; GPIO14 -12.7,-5.08; GPIO15 12.7,-15.24; GPIO16 12.7,-5.08; GPIO17 12.7,-2.54; GPIO18 12.7,2.54; GPIO19 12.7,5.08; GPIO21 12.7,10.16; GPIO22 12.7,17.78; GPIO23 12.7,20.32; GPIO25 -12.7,2.54; GPIO26 -12.7,0; GPIO27 -12.7,-2.54; GPIO32 -12.7,7.62; GPIO33 -12.7,5.08; GPIO34 -12.7,12.7; GPIO35 -12.7,10.16; SN -12.7,15.24; SP -12.7,17.78
C0805 = smd 1.3 x 1.5: 1 -0.95,0; 2 0.95,0
E2,5-6L = drill 0.8 pad 1.6: + -1.27,0 | drill 0.8 pad 1.6 octagon: - 1.27,0
MYLIB_C0805 = smd 1.3 x 1.5: 1 -0.85,0; 2 0.85,0
MYRCL_C0603 = smd 1.1 x 1: 1 -0.85,0; 2 0.85,0
MYRCL_C0603K = smd 1.05 x 1.08: 1 -0.875,0; 2 0.875,0
MYRCL_C0402 = smd 0.7 x 0.9: 1 -0.65,0; 2 0.65,0
CAP_EEHZA1H680P = smd 4 x 2: 1 -3.55,0; 2 3.55,0
C1210 = smd 1.6 x 2.7: 1 -1.4,0; 2 1.4,0
PANASONIC_G = smd 3.9 x 1.6: + 4.25,0; - -4.25,0
TE5 = drill 1 long: 1 -2.54,0; 2 2.54,0
CHIPLED_0805 = smd 1.2 x 1.2: A 0,-1.05; C 0,1.05
SOT65P280X110-8N = smd 1.37 x 0.48: 1 -1.15,0.975; 2 -1.15,0.325; 3 -1.15,-0.325; 4 -1.15,-0.975; 5 1.15,-0.975; 6 1.15,-0.325; 7 1.15,0.325; 8 1.15,0.975
0204/7@1 = drill 0.8 octagon: 1 -3.81,0; 2 3.81,0
WE-TPC_5818/5828 = smd 2.2 x 6.3: 1 -2,0; 2 2.01,0
WE-PD_1280P = smd 5.4 x 2.9: 1 0,4.95; 2 0,-4.95
DPACK = smd 1.6 x 3: 1 -2.28,-4.8; 3 2.28,-4.8 | smd 5.8 x 6.2: 4 0,2.38
MSOP8 = smd 0.4 x 1.2: 1 -0.975,-2.05; 2 -0.325,-2.05; 3 0.325,-2.05; 4 0.975,-2.05; 5 0.975,2.05; 6 0.325,2.05; 7 -0.325,2.05; 8 -0.975,2.05
TRANS_BSZ100N06LS3_G = smd 0.8 x 0.34: 1 -1.5,0.975; 2 -1.5,0.325; 3 -1.5,-0.325; 4 -1.5,-0.975 | smd 0.8 x 0.8: 5_8 0.4,0
R0805 = smd 1.3 x 1.5: 1 -0.95,0; 2 0.95,0
RCL_STRH_R0805 = smd 1.3 x 1.5: 1 -0.95,0; 2 0.95,0
SMD-20SN = smd 2 x 2: TP 0,0
IC_TPS55288RPMR = smd 0.2 x 0.2: 1 -1.65,1.575; 7 -1.65,-1.575; 13 1.65,-1.575; 19 1.65,1.575 | smd 0.6 x 0.25: 2 -1.9,1; 6 -1.9,-1; 14 1.9,-1; 18 1.9,1 | smd 0.725 x 0.25: 3 -1.837,0.5; 4 -1.837,0; 5 -1.837,-0.5; 15 1.837,-0.5; 16 1.837,0; 17 1.837,0.5 | smd 0.25 x 0.625: 8 -1.125,-1.637; 9 -0.625,-1.637; 10 -0.125,-1.637; 11 0.625,-1.637; 12 1.125,-1.637 | smd 0.25 x 0.675: 20 1.05,1.613; 23 -1.05,1.613 | smd 0.25 x 0.6: 21 0.25,1.65; 22 -0.25,1.65 | smd 0.375 x 1.425: 24 -0.625,0; 25 0,0; 26 0.625,0
SMC = smd 2.8 x 3.8: A 3.7,0; C -3.7,0
DCJ0202 = drill 1 pad 2 long: 1 0,3.1; 2 4.8,0; 3 0,-3
JUMPER_JP3 = drill 0.914 octagon: 1 -2.54,0; 2 0,0; 3 2.54,0
BANANAJACK = drill 2.2 octagon: P$1 0,0 | drill 1.3 octagon: P$2 -3.8,5.08; P$3 -3.8,-5.08; P$4 6.63,-5.08; P$5 6.63,5.08
GND-GNDA = smd 1.27 x 1.27: GND -1.27,0; PGND 1.27,0

### Placement (x,y rotation side)
A1  58.22,48.36 90 top
BOM  [BOM]  0.58,-1.95 0 top
C1  12.28,35.82 180 top
C2  12.28,32.49 180 top
C3  5.39,28.42 180 top
C4  20.58,21.16 90 top
C5  25.08,13.87 180 top
C6  25.03,16.13 180 top
C7  47.19,18.04 90 top
C8  39.17,18.07 90 top
C9  42.09,18.07 90 top
C10  44.63,18.05 90 top
C11  16.67,16.13 0 top
C12  16.66,18.33 0 top
C13  16.11,24.19 0 top
C14  100.28,11.34 270 top
C15  97.73,17.89 90 top
C16  97.69,22.15 90 top
C17  70.22,18.98 270 top
C18  77.21,18.25 270 top
C19  100.92,15.91 270 top
C20  63.8,20.1 270 top
C21  53.8,20.1 270 top
C22  99.99,24.88 90 top
C23  102.35,25.84 90 top
C24  73.6,18.65 270 top
C25  102.28,33.21 0 top
C26  101.06,30.08 270 top
C27  149.94,18.21 0 top
C28  136.56,18.51 90 top
C29  104.98,20.64 270 top
C30  107.16,20.55 270 top
C31  109.92,20.53 270 top
C32  112.41,20.54 270 top
C33  118.73,27.49 270 top
C34  127.08,18.92 90 top
F1  14.03,47.87 0 top
FABRICATION  [FABRIACTION]  38.92,-9.9 0 top  (outside the outline)
H1  12.14,30.38 90 top
IC1  151.04,21.98 0 top
L1  17.33,32.62 270 top
L2  24.98,20.89 0 top
L3  89.71,23.49 90 top
MEASURE  [MEASURE]  0.43,-1.8 0 top
N1  33.4,17.06 180 top
N2  16.23,21.13 270 top
Q1  80.48,16.86 180 top
Q2  85.59,14.53 90 top
R1  12.44,18.32 180 top
R2  11.56,23.91 90 top
R3  9.13,23.92 270 top
R4  102.72,6.99 90 top
R5  97.98,7 90 top
R6  100.34,6.96 90 top
R7  105.67,6.67 270 top
R8  14.02,27.47 270 top
R9  102.68,11.35 90 top
R10  81.76,21.75 270 top
R11  94.24,14.54 180 top
R12  106.77,28.15 270 top
R13  103.69,29.99 90 top
R14  107.7,16.98 0 top
R15  139.54,18.53 90 top
R16  142.36,18.51 270 top
TP1  124.57,54.91 180 top
TP2  84.11,31.86 90 top
TP3  94.61,31.3 90 top
TP4  118.43,36.21 90 top
TP5  138.8,2.4 90 top
TP6  141.8,2.4 0 top
U1  101.76,20.53 90 top
V1  13.77,40.74 180 top
X1  4.88,44.55 270 top
X2  111.97,11.21 270 top
X3  101.39,2.66 180 top
X4  115.33,11.22 90 top
X5  108.8,11.32 90 top
X6  151.32,54.32 0 top
X7  151.1,38.68 0 top
X8  158.28,22.4 90 top
~NUDEV~1  99.75,27.79 180 top

### Tracks (layer width: path | path; a pad name or v marks a point on that pad's centre or on a via)
+3.3  (via drill 0.35)
  Top 0.254: 147.12,14.58 v147.06,14.64
  Top 0.406: IC1.4 149.89,20.01 149.09,19.21 C27.1
  Top 0.508: N1.4 33.4,33.7 A1.3V3 | C27.1 149.09,16.55 147.12,14.58 | v50.6,11.53 47.19,14.94 C7.1
  Route15 0.508: v147.06,14.64 142.61,14.64 131.88,3.91 58.22,3.91 v50.6,11.53
  pour Top (isolate 0.406, no thermals): 30.28,18.52 36.63,18.52 37.52,17.63 48.06,17.63 48.06,11.66 30.28,11.66
+5V
  Top 0.203: 100.36,7.94 R6.2 | 98.01,7.91 R5.2 | 81.46,9.39 81.21,9.65
  Top 0.305: 26.99,22.01 L2.2
  Top 0.508: R2.2 13.22,26.52 R8.2 14.27,26.77 22.23,26.77 26.99,22.01 | R4.2 100.36,7.94 | R6.2 98.01,7.91 | 81.21,9.65 27.72,9.65 26.03,11.34 C5.1 25.98,13.92 | R5.2 97.6,7.95 96.15,9.39 81.46,9.39
  pour Top (isolate 0.406, no thermals): 25.89,24.11 25.89,12.67 28.63,12.67 28.63,20.42 31.93,20.42 31.93,24.11
+V
  pour Top (no thermals): 99.82,22 100.53,22 100.53,23.17 102.05,24.69 103.2,24.69 103.2,24.7 103.2,25.59 103.12,25.67 102.1,25.67 101.07,24.63 99.41,24.63 99.41,22.36 99.74,22.03 99.75,22.03 99.75,22.03 99.75,22.07
ADDRSEL
  Top 0.254: X8.2 157.27,21.4 155.03,21.4 154.12,22.31 IC1.7
BOOT1
  Top 0.254: U1.22 99.58,20.29 98.04,18.74 C15.2
BOOT2
  Top 0.254: C16.2 98.27,23 99.68,21.58 U1.20
DR1H  (via drill 0.35, 0.35 pad 0.51)
  Top 0.203: v100.03,17.53 100.14,17.53 100.76,18.15 U1.2
  Top 0.305: v81.92,26.26 81.92,26.17 81.76,26.01 R10.1
  Bottom 0.508: v81.92,26.26 91.3,26.26 v100.03,17.53
DR1L
  Top 0.203: U1.1 100.11,18.88 99.34,18.12 99.34,15.76 98.13,14.54 R11.1
EN
  Top 0.203: U1.4 101.76,13.77 | X4.2 113.95,12.6 108.44,12.6 107.27,13.77 101.75,13.77 C14.1
  Top 0.254: 101.76,13.77 C14.1
ISN  (via drill 0.35)
  Top 0.203: U1.13 104.11,22.96 115.27,22.96 117.8,25.49 139.44,25.49 141.1,23.82 141.1,18.21 140.47,17.59 R15.1
  Top 0.254: 144.89,17.56 R16.2
  Top 0.406: IC1.1 149.38,23.47 v148.26,23.47
  Top 0.508: v145.85,18.52 144.89,17.56
  Bottom 0.254: v148.26,23.47 145.85,21.05 v145.85,18.52
  pour Top (isolate 0.406, no thermals): 135.69,17.88 146.1,17.88 146.1,15.34 135.69,15.34
ISP  (via drill 0.2 pad 0.2, 0.35)
  other vias: 101.45,21.39 102.24,21.39 102.92,21.39 108.39,24.87 138.87,22.96 138.87,24.23 137.59,24.23 137.59,22.96 136.32,22.96 136.32,24.23 135.06,24.23 135.06,22.96 133.78,22.96 133.78,24.23 133.78,21.69 135.06,21.69 138.23,21.69 139.5,21.69 132.52,21.69 132.52,22.96 132.52,24.23 131.25,24.23 131.25,22.96 131.25,21.69 129.97,21.69 129.97,22.96 129.97,24.23 128.71,24.23 128.71,22.96 128.71,21.69 124.89,24.23 124.89,22.96 124.89,21.69 123.62,21.69 122.36,21.69 122.36,22.96 122.36,24.23 123.62,24.23 123.62,22.96
  pour Top (no thermals): 101.02,21.69 113.9,21.69 113.9,21.03 101.02,21.03
  pour Top (no thermals): 104.52,22.96 104.52,21.69 114.1,21.69 114.1,22.96
  pour Top (no thermals): 138.51,21.05 112.55,21.05 116.65,25.15 139.16,25.15 140.5,23.82 140.5,18.88 138.51,18.88
  pour Route15 (isolate 0.254, rank 2, no thermals): 100.77,25.5 100.77,21.05 138.23,21.05 138.23,18.52 140.77,18.52 140.77,25.5
MODE  (via drill 0.35, 0.35 pad 0.51)
  Top 0.203: U1.15 102.26,23.18 102.42,23.34 105.46,23.34 v106.07,23.95
  Top 0.305: X5.2 108.23,11.89 v106.07,11.89
  Bottom 0.203: v106.07,23.95 v106.07,11.89
N$1
  pour Top (no thermals): 6.15,50.9 12.5,50.9 12.5,43.79 6.15,43.79
N$2
  Top 0.406: N2.7 19.53,21.46 20.18,22.11 C4.2
N$3
  pour Top (isolate 0.406, no thermals): 81.08,21.31 81.08,20.04 81.44,19.68 81.44,17.75 82.48,17.75 82.48,21.31
N$5
  Top 0.305: R11.2 91.77,13.03 Q2.4
N$7
  Top 0.305: R6.1 100.34,5.12 101.15,4.32 104.19,4.32 105.6,5.72 R7.2 115.91,5.72 117.91,7.72 117.91,11.53 115.68,13.76 X4.3
N$9  (via drill 0.35 pad 0.51)
  Top 0.152: R4.1 103.18,6.04 | v104.53,10.41 104.25,10.12
  Top 0.203: 103.18,6.04 104.25,7.1 104.25,10.12
  Bottom 0.203: v104.53,10.41 104.83,10.11 110.53,10.11 X2.3
N$10
  Top 0.305: R5.1 97.98,3.54 X3.3
N$12
  Top 0.203: R13.2 103.69,32.65 C25.2
N$13  (via drill 0.35, 0.35 pad 0.51)
  Top 0.152: v99.71,31 100.99,31 C26.1
  Top 0.203: U1.18 100.76,22.95 101.91,24.1 104.07,24.1 104.07,24.13 v104.32,24.38
  Top 0.305: C25.1 101.43,31.29 C26.1
  Bottom 0.152: 104.76,25.77 99.62,30.91 v99.71,31
  Bottom 0.203: v104.32,24.38 104.76,24.82 104.76,25.77
N$14
  Top 0.152: U1.8 103.77,19.41 106.19,16.98 R14.1
N$15
  Top 0.203: U1.17 101.26,22.82 102.16,23.72 104.82,23.72 106.77,25.67 R12.2
N$17
  Top 0.254: R8.1 13.83,28.4 13.83,29.75 H1.A
N$18
  Top 0.254: X5.1 107.28,8.78 103.76,12.29 102.69,12.29 R9.2
N$19
  Top 0.254: N2.3 14.17,20.8 12.5,20.8 11.49,19.79 R1.2
N$20
  pour Top (isolate 0.406, no thermals): 12.75,38.2 12.75,34.39 18.85,34.39 18.85,50.9 15.04,50.9 15.04,38.2
N$29
  Top 0.406: C4.1 20.58,20.53 20.31,20.8 18.29,20.8 N2.6
  pour Top (isolate 0.305, no thermals): 19.61,20.87 21.77,20.87 21.77,24.1 24.31,24.1 24.31,17.75 24.18,17.63 19.61,17.63
N$31
  pour Top (isolate 0.305, no thermals): 8.44,23.72 13.52,23.72 13.52,22.58 15.17,22.58 15.17,21.82 8.44,21.82
N$34
  Top 0.254: N2.2 15.26,21.46 15.74,21.94 15.74,23.63 15.18,24.19 C13.1
PGND  (via drill 0.2 pad 0.2, 0.2 pad 0.41, 0.25, 0.25 pad 0.51, 0.35)
  Top 0.203: C19.2 100.92,15.1
  Top 0.254: X8.1 160.38,19.86 v160.46,19.79 | R14.2 110.66,16.98 v110.92,17.25 | R7.1 105.67,8.75 v105.6,8.81 | IC1.3 149.92,21.69
  Top 0.356: IC1.3 149.92,21.69 | 150.95,18.37 C27.2
  Top 0.406: 100.92,15.1 99.89,14.07 v99.5,14.07 | IC1.3 150.72,21.66 150.98,21.4 151,21.37 v151,19.61 150.79,19.4 C27.2
  other vias: 18.6,22.96 18.6,23.72 18.6,24.48 18.6,25.25 19.36,16.86 20.88,16.86 22.41,16.86 19.36,16.1 20.88,16.1 22.41,16.1 22.41,15.34 20.88,15.34 19.36,15.34 19.36,14.58 20.88,14.58 22.41,14.58 22.41,13.82 20.88,13.82 19.36,13.82 19.36,13.05 20.88,13.05 22.41,13.05 17.07,22.2 17.07,21.05 17.83,14.58 17.83,13.82 17.83,13.05 38.66,21.31 39.93,21.31 39.93,22.58 38.66,22.58 38.66,23.85 39.93,23.85 41.2,23.85 41.2,22.58 41.2,21.31 42.47,21.31 42.47,22.58 42.47,23.85 43.74,23.85 43.74,22.58 43.74,21.31 45.01,21.31 45.01,22.58 45.01,23.85 46.28,23.85 46.28,22.58 46.28,21.31 47.55,21.31 47.55,22.58 47.55,23.85 10.34,28.42 11.61,28.42 10.34,34.14 3.36,25.25 4.63,25.25 5.9,25.25 7.17,25.25 7.17,26.52 5.9,26.52 4.63,26.52 3.36,26.52 2.09,26.52 2.09,25.25 2.09,27.79 2.09,29.06 2.09,30.33 3.36,30.33 4.63,30.33 4.63,31.6 3.36,31.6 2.09,31.6 2.09,32.87 3.36,32.87 4.63,32.87 4.63,34.14 3.36,34.14 2.09,34.14 2.09,35.41 3.36,35.41 4.63,35.41 4.63,36.68 3.36,36.68 2.09,36.68 2.09,37.95 3.36,37.95 4.63,37.95 3.36,41.76 4.63,41.76 2.09,41.76 3.36,43.03 4.63,43.03 4.63,44.3 3.36,44.3 3.36,45.57 4.63,45.57 4.63,46.84 3.36,46.84 53.27,12.42 54.54,12.42 54.54,13.69 53.27,13.69 55.81,13.69 55.81,12.42 57.08,12.42 57.08,13.69 58.35,13.69 58.35,12.42 59.62,12.42 59.62,13.69 60.89,13.69 60.89,12.42 62.16,12.42 62.16,13.69 63.43,13.69 63.43,12.42 64.7,12.42 64.7,13.69 65.97,13.69 65.97,12.42 67.24,13.69 67.24,14.96 68.51,14.96 69.78,14.96 68.51,13.69 69.78,13.69 69.78,12.42 68.51,12.42 67.24,12.42 69.78,16.23 71.05,16.23 76.13,16.23 72.32,14.96 71.05,14.96 71.05,13.69 72.32,13.69 73.59,13.69 73.59,14.96 74.86,14.96 76.13,14.96 74.86,13.69 76.13,13.69 76.13,12.42 74.86,12.42 73.59,12.42 72.32,12.42 71.05,12.42 58.35,14.96 59.62,14.96 60.89,14.96 65.97,14.96 57.08,14.96 55.81,14.96 83.75,11.78 85.02,11.78 85.02,10.51 83.75,10.51 82.48,10.51 82.48,11.78 82.48,13.05 101.6,19.68 102.39,19.71 103.28,20.12 97.79,29.21 99.06,29.21 97.79,27.94 97.79,26.67 98.56,26.67 98.81,27.94 97.59,10.89 98.6,10 116,19.15 117.91,19.15 119.81,19.15 121.72,19.15 122.99,19.15 124.26,19.15 125.53,19.15 126.8,19.15 128.07,19.15 129.34,19.15 130.61,19.15 131.88,19.15 133.15,19.15 134.42,19.15 131.88,17.88 130.61,17.88 129.34,17.88 128.07,17.88 126.8,17.88 125.53,17.88 124.26,17.88 122.99,17.88 122.99,16.61 124.26,16.61 125.53,16.61 129.34,16.61 130.61,16.61 131.88,16.61 122.99,15.34 124.26,15.34 125.53,15.34 129.34,15.34 130.61,15.34 131.88,15.34 131.88,14.07 130.61,14.07 129.34,14.07 125.53,14.07 124.26,14.07 122.99,14.07 122.99,12.8 124.26,12.8 125.53,12.8 129.34,12.8 130.61,12.8 131.88,12.8 131.88,11.53 130.61,11.53 129.34,11.53 128.07,11.53 126.8,11.53 125.53,11.53 124.26,11.53 122.99,11.53 117.91,44.55 119.18,44.55 120.45,44.55 121.72,44.55 122.99,44.55 124.26,44.55 125.53,44.55 126.8,44.55 128.07,44.55 129.34,44.55 130.61,44.55 130.61,43.28 129.34,43.28 128.07,43.28 126.8,43.28 125.53,43.28 124.26,43.28 122.99,43.28 121.72,43.28 120.45,43.28 119.18,43.28 117.91,43.28 117.91,42.01 119.18,42.01 120.45,42.01 121.72,42.01 122.99,42.01 124.26,42.01 125.53,42.01 126.8,42.01 128.07,42.01 129.34,42.01 130.61,42.01 130.61,40.74 129.34,40.74 128.07,40.74 126.8,40.74 125.53,40.74 124.26,40.74 122.99,40.74 121.72,40.74 120.45,40.74 119.18,40.74 117.91,40.74 117.91,39.47 119.18,39.47 120.45,39.47 121.72,39.47 122.99,39.47 124.26,39.47 125.53,39.47 126.8,39.47 128.07,39.47 129.34,39.47 130.61,39.47 130.61,38.2 129.34,38.2 128.07,38.2 126.8,38.2 125.53,38.2 124.26,38.2 122.99,38.2 121.72,38.2 120.45,38.2 117.91,38.2 119.18,38.2 120.45,36.93 121.72,36.93 122.99,36.93 124.26,36.93 125.53,36.93 126.8,36.93 128.07,36.93 129.34,36.93 130.61,36.93 130.61,35.66 129.34,35.66 128.07,35.66 126.8,35.66 125.53,35.66 124.26,35.66 122.99,35.66 121.72,35.66 120.45,35.66 120.45,34.39 120.45,33.12 121.72,33.12 121.72,34.39 122.99,34.39 122.99,33.12 124.26,33.12 124.26,34.39 125.53,34.39 126.8,34.39 128.07,34.39 129.34,34.39 130.61,34.39 130.61,33.12 129.34,33.12 128.07,33.12 126.8,33.12 125.53,33.12 125.53,31.85 125.53,30.58 126.8,30.58 126.8,31.85 128.07,31.85 128.07,30.58 129.34,30.58 129.34,31.85 130.61,31.85 130.61,30.58 131.88,30.58 133.15,30.58 134.42,30.58 135.69,30.58 136.96,30.58 138.23,30.58 139.5,30.58 139.5,31.85 138.23,31.85 136.96,31.85 136.96,33.12 138.23,33.12 139.5,33.12 139.5,34.39 138.23,34.39 136.96,34.39 136.96,35.66 138.23,35.66 139.5,35.66 131.88,35.66 133.15,35.66 134.42,35.66 135.69,35.66 131.88,34.39 131.88,33.12 131.88,31.85 133.15,31.85 134.42,31.85 135.69,31.85 131.88,39.47 131.88,38.2 131.88,36.93 133.15,36.93 133.15,38.2 133.15,39.47 133.15,40.74 131.88,40.74 134.42,40.74 134.42,39.47 134.42,38.2 134.42,36.93 135.69,36.93 135.69,38.2 135.69,39.47 135.69,40.74 133.15,42.01 131.88,42.01 131.88,43.28 131.88,44.55 134.42,42.01 135.69,42.01 135.69,44.55 134.42,43.28 133.15,44.55 134.42,44.55 135.69,43.28 133.15,33.12 135.69,34.39 133.15,34.39 133.15,43.28
  pour Bottom (isolate 0.254): -2.74,75.66 171.78,75.66 171.78,-0.57 -2.74,-0.57
  pour Top (isolate 0.406, no thermals): 16.84,25.5 19.25,25.5 19.25,22.36 18.85,21.95 17.34,21.95 17.32,21.94 17.32,20.46 18.95,20.46 19.12,20.28 19.12,17.2 19.11,17.19 24.75,17.19 24.75,12.64 16.84,12.64
  pour Route2 (isolate 0.406): -3.38,75.03 175.06,75.03 175.06,-3.71 -3.38,-3.71
  pour Top (isolate 0.406, no thermals): 8.54,42.65 12.75,42.65 12.75,38.96 11.99,38.96 11.99,27.53 10.09,27.53 10.09,24.48 0.94,24.48 0.94,47.09 5.13,47.09 5.13,26.77 8.54,26.77
  pour Top (isolate 0.406, no thermals): 34.73,24.87 34.73,19.79 37.9,19.79 37.9,18.52 48.06,18.52 48.06,24.87
  pour Top (isolate 0.406, no thermals): 81.46,13.44 85.91,13.44 85.91,10.01 81.46,10.01
  pour Top (isolate 0.406, no thermals): 52.51,18.52 77.23,18.52 77.23,12.17 52.51,12.17
  pour Top (no thermals): 102.97,20.5 104.47,20.5 104.47,20.17 102.97,20.17
  pour Top (no thermals): 101.07,20.47 106.91,20.47 106.91,19.68 102.64,19.68 102.39,19.43 101.07,19.43
  pour Top (no thermals): 106.48,20.42 106.53,20.37 113.39,20.37 113.39,18.41 106.51,18.41 106.48,18.44
  pour Top (isolate 0.406, no thermals): 113.44,20.29 137.47,20.29 137.47,18.72 133.66,18.72 133.15,18.21 133.15,10.82 133.1,10.77 121.97,10.77 121.95,10.74 121.95,18.54 113.44,18.54
  pour Top (no thermals): 116.64,45.82 116.64,29.31 153.47,29.31 153.47,45.82
  pour Top (no thermals): 97.59,29.97 100.64,29.97 100.64,25.16 97.59,25.16
  pour Top (no thermals): 106.61,18.4 105.07,18.4 103.69,19.79 103.69,20.04 106.73,20.04 106.61,19.91
  pour Top (no thermals): 99.24,29.95 110.16,29.95 110.16,26.19 99.24,26.19
  pour Top (no thermals): 99.5,26.26 99.06,25.83 99.06,25.12 100.77,25.12 100.77,26.26
  pour Route2: -2.74,76.3 176.33,76.3 176.33,-2.44 175.69,-3.08 -2.74,-3.08
  pour Top (no thermals): 96.95,11.53 103.31,11.53 103.31,9.62 96.95,9.62
  pour Route15 (isolate 0.254, rank 3, no thermals): -2.74,76.3 176.97,76.3 176.97,-7.52 -2.74,-7.52
SCL  (via drill 0.35)
  Top 0.254: IC1.5 153.47,19.72 153.47,15.34 v152.84,14.71 | v142.68,3.91 142.68,3.28 TP6.TP 140.13,0.74 103.32,0.74 X3.2 | U1.5 102.26,17.02 v102.67,16.61 | A1.GPIO18 62.03,54.71 76.97,54.71 96.32,35.36 v96.32,35.02
  Route2 0.254: v152.84,14.71 152.84,14.07 v142.68,3.91
  Bottom 0.203: X3.2 103.86,5.14 103.86,16.61 103.86,19.87 105.14,21.14 105.14,26.84 97.59,34.39
  Bottom 0.254: v102.67,16.61 103.86,16.61 | v96.32,35.02 96.95,35.02 97.59,34.39
SDA  (via drill 0.35, 0.35 pad 0.51)
  Top 0.152: U1.6 102.76,18.23 105.48,15.52 v107.19,15.52
  Top 0.203: A1.GPIO22 54.41,47.09 66.27,47.09 75.79,37.56 v93.14,37.56
  Top 0.254: TP5.TP 139.5,3.1 v139.5,5.18 v144.58,10.26 | X2.2 113.03,11.21 113.72,10.51 v113.72,6.7 | IC1.6 152.91,21.66 153.2,21.37 153.2,21.33 154.1,20.42 154.1,19.84 v154.16,19.79
  Route2 0.254: v144.58,10.26 154.1,19.79 v154.16,19.79
  Bottom 0.203: X2.2 110.07,13.11 110.07,14.18 109.27,14.98 107.73,14.98 v107.19,15.52 106.73,15.97 106.73,26.52 95.69,37.56 v93.14,37.56
  Bottom 0.254: v113.72,6.7 137.98,6.7 v139.5,5.18
SW1
  Top 0.254: 98.86,17.94 97.95,17.04 C15.1
  Top 0.305: U1.23 99.68,19.49 98.86,18.67 98.86,17.94
  pour Top (isolate 0.406, no thermals): 82.98,33.12 82.98,13.96 87.43,13.96 87.43,33.12
  pour Top (isolate 0.406, no thermals): 81.46,17.25 82.98,17.25 82.98,13.88 81.46,13.88
  pour Top (no thermals): 86.66,17.88 100.45,17.88 100.45,16.45 99.99,15.99 86.66,15.99
SW2
  Top 0.305: C16.1 98.2,20.78 U1.21 100.13,20.76 100.53,20.76 100.76,20.53 U1.25
  pour Top (no thermals): 92.9,33.12 96.05,33.12 96.05,22.34 96.86,21.53 100.45,21.53 100.45,20.56 92.9,20.56
VCC  (via drill 0.35)
  Top 0.203: 100.44,16.56 C19.1 100.92,16.77 101.25,17.1 101.25,18.46 101.26,18.46 U1.3
  Top 0.508: 100.44,16.56 v100,16.12
  Route15 0.508: v100,16.12 80.93,16.12 78.67,18.39 v78.67,19.49
  other vias: 15.04,33.12 17.58,33.12 17.58,30.58 15.04,31.85 17.58,31.85 13.77,16.61 13.27,15.68 14.54,14.41 13.27,14.41 68.51,25.84 69.78,25.84 71.05,25.84 72.32,25.84 73.59,25.84 74.86,25.84 76.13,25.84 77.4,25.84 78.67,25.84 79.94,25.84 68.51,24.57 69.78,24.57 71.05,24.57 72.32,24.57 73.59,24.57 74.86,24.57 76.13,24.57 77.4,24.57 78.67,24.57 79.94,24.57 79.94,19.49 79.94,20.76 79.94,22.03 78.67,20.76 78.67,22.03 78.67,23.3 79.94,23.3 77.4,23.3 76.13,23.3 74.86,23.3 73.59,23.3 72.32,23.3 71.05,23.3 68.51,23.3 69.78,23.3 69.78,22.03 71.05,22.03 72.32,22.03 73.59,22.03 74.86,22.03 76.13,22.03 77.4,22.03 77.4,20.76
  pour Top (isolate 0.406, no thermals): 12.75,33.63 12.75,31.34 16.56,31.34 16.56,27.53 18.85,27.53 18.85,33.63
  pour Top (isolate 0.406, no thermals): 12.75,20.17 16.31,20.17 16.31,13.94 12.75,13.94
  pour Top (isolate 0.406, no thermals): 52.51,26.77 52.51,19.53 77.52,19.53 80.32,16.74 80.32,26.77
  pour Top (isolate 0.406, no thermals): 78.27,18.52 78.27,12.02 80.91,12.02 80.91,18.52
  pour Route15 (isolate 0.254): 4.88,31.85 4.88,8.99 81.08,8.99 81.08,33.12 6.15,33.12
VOUT
  pour Top (no thermals): 141.66,19.15 141.66,26.14 149.66,26.14 149.66,19.15
  pour Top (no thermals): 141.41,27.41 141.41,22.07 151.95,22.07 151.95,22.58 172.9,22.58 172.9,63.73 116.89,63.73 116.89,48.36 156.52,48.36 156.52,27.41

### Text on the board
Route2: .
tNames: © Sekulic Stefan / 4BHEL / HTBLuVA Salzburg / V1R1
tDocu: VOUT | SCL | SDA